# EasyEDA Pro project Karma_flight_ computer.epro

# Schematic FLIGHT COMPUTER-2

## Sheets
1 FLIGHT COMPUTER - 2: Board Name: FLIGHT COMPUTER-2; Create Date: 2025-08-07; Page Name: FLIGHT COMPUTER - 2; Project Name: KARMA-FC; Schematic Name: FLIGHT COMPUTER-2; Update Date: 2025-08-09; Add into BOM: yes; Company: VRT; Convert to PCB: yes; Date: 2025-07-24; Draw By: amit.shukla3011; REV: 1.0; Sheet: 1/1; spicePre: .
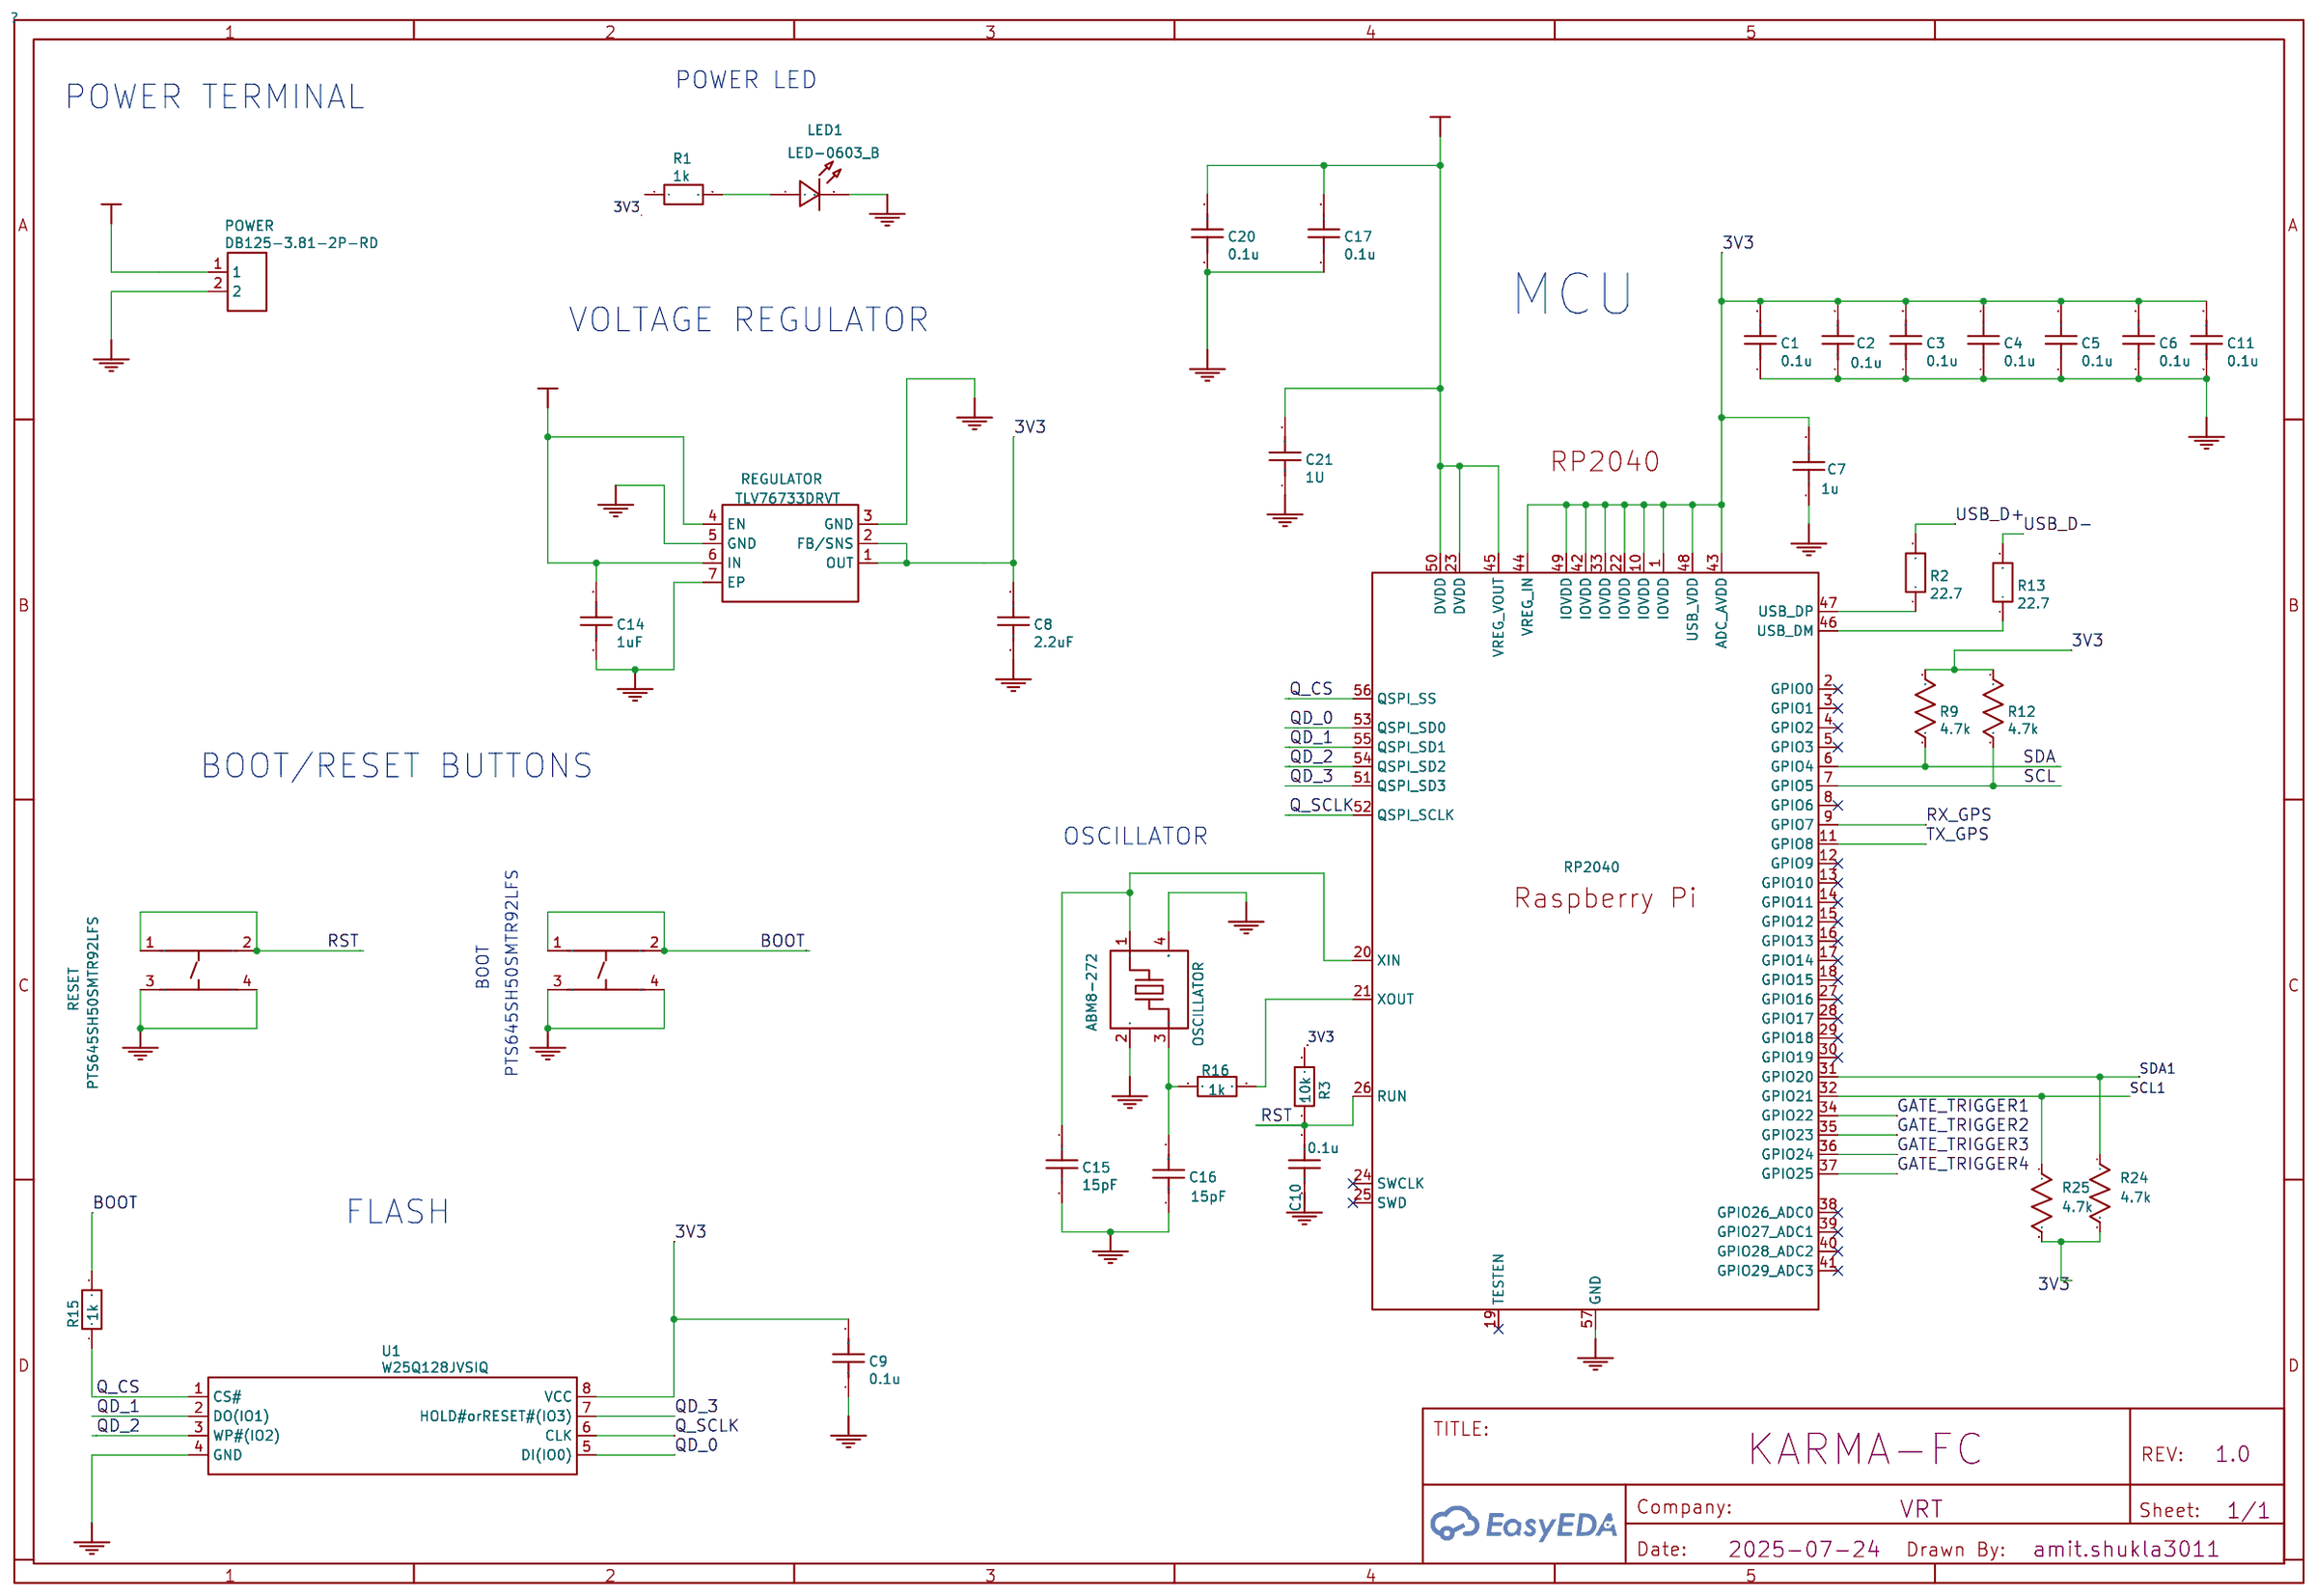
[diagram p0: FLIGHT COMPUTER - 2]
2 Sheet_2: Page Name: Sheet_2; Company: Your Company; Date: 2025-07-28
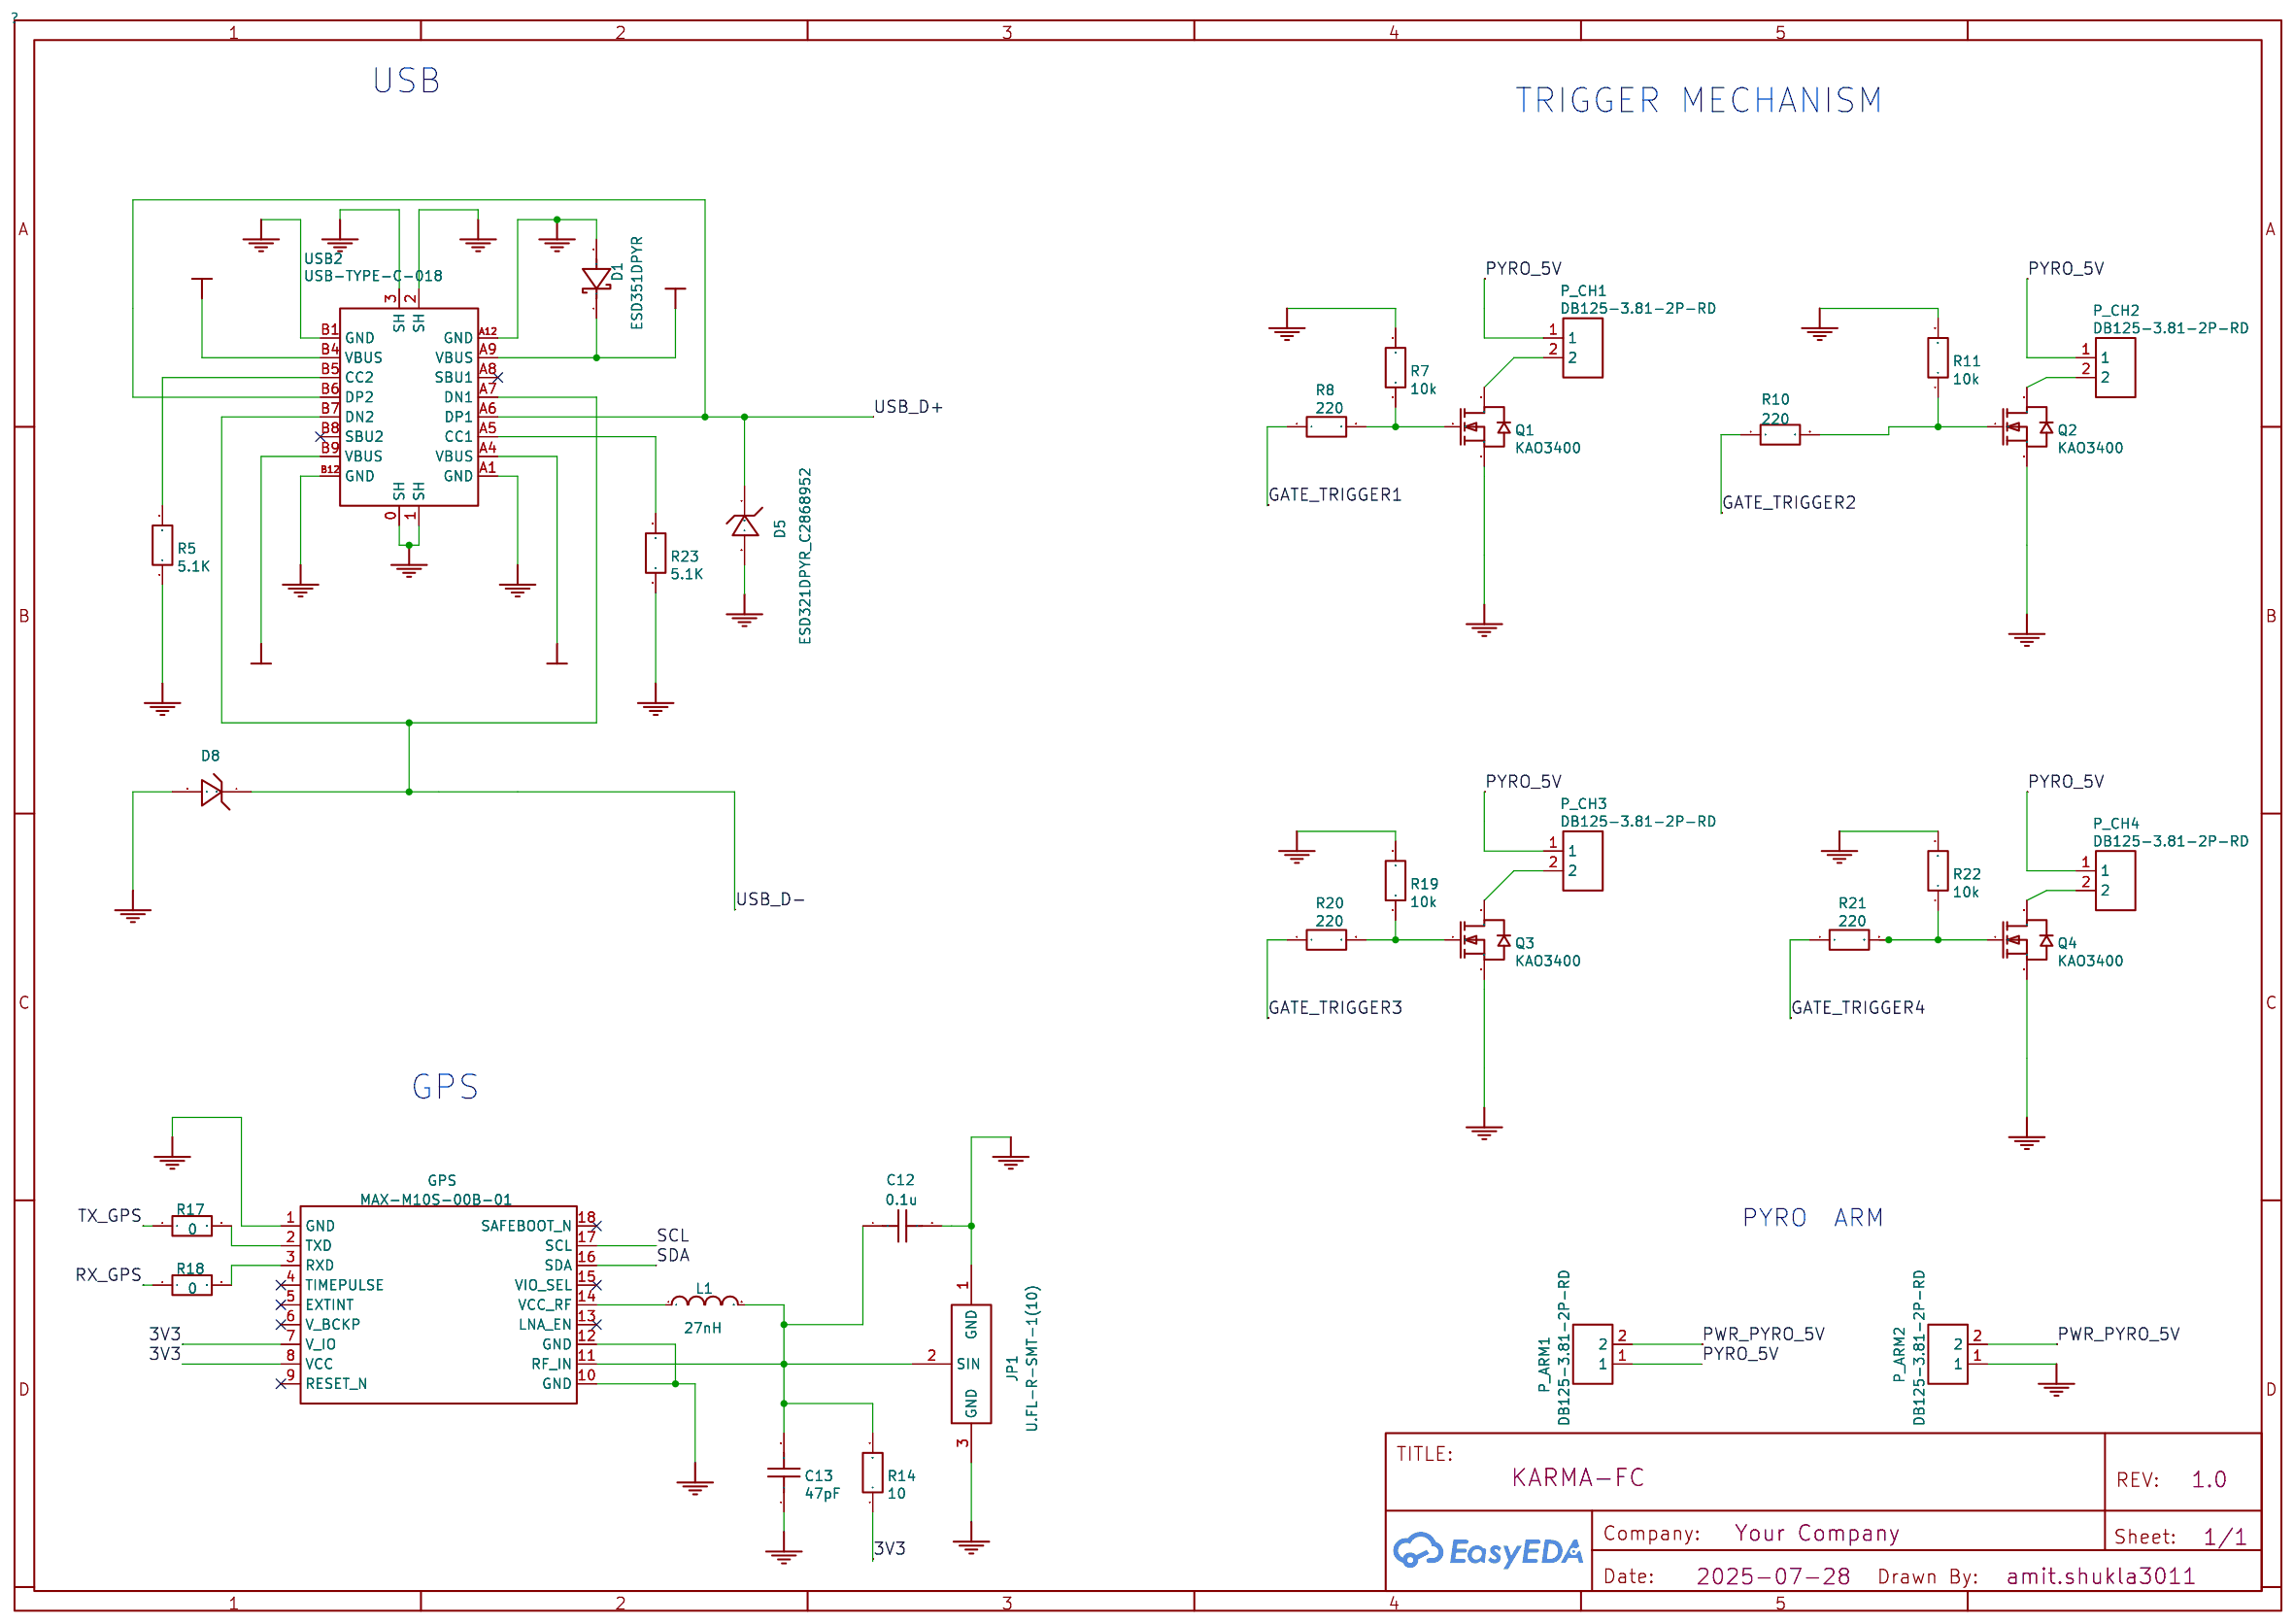
[diagram p1: Sheet_2]
3 Sheet_3: Page Name: Sheet_3; Company: Your Company; Date: 2025-07-28
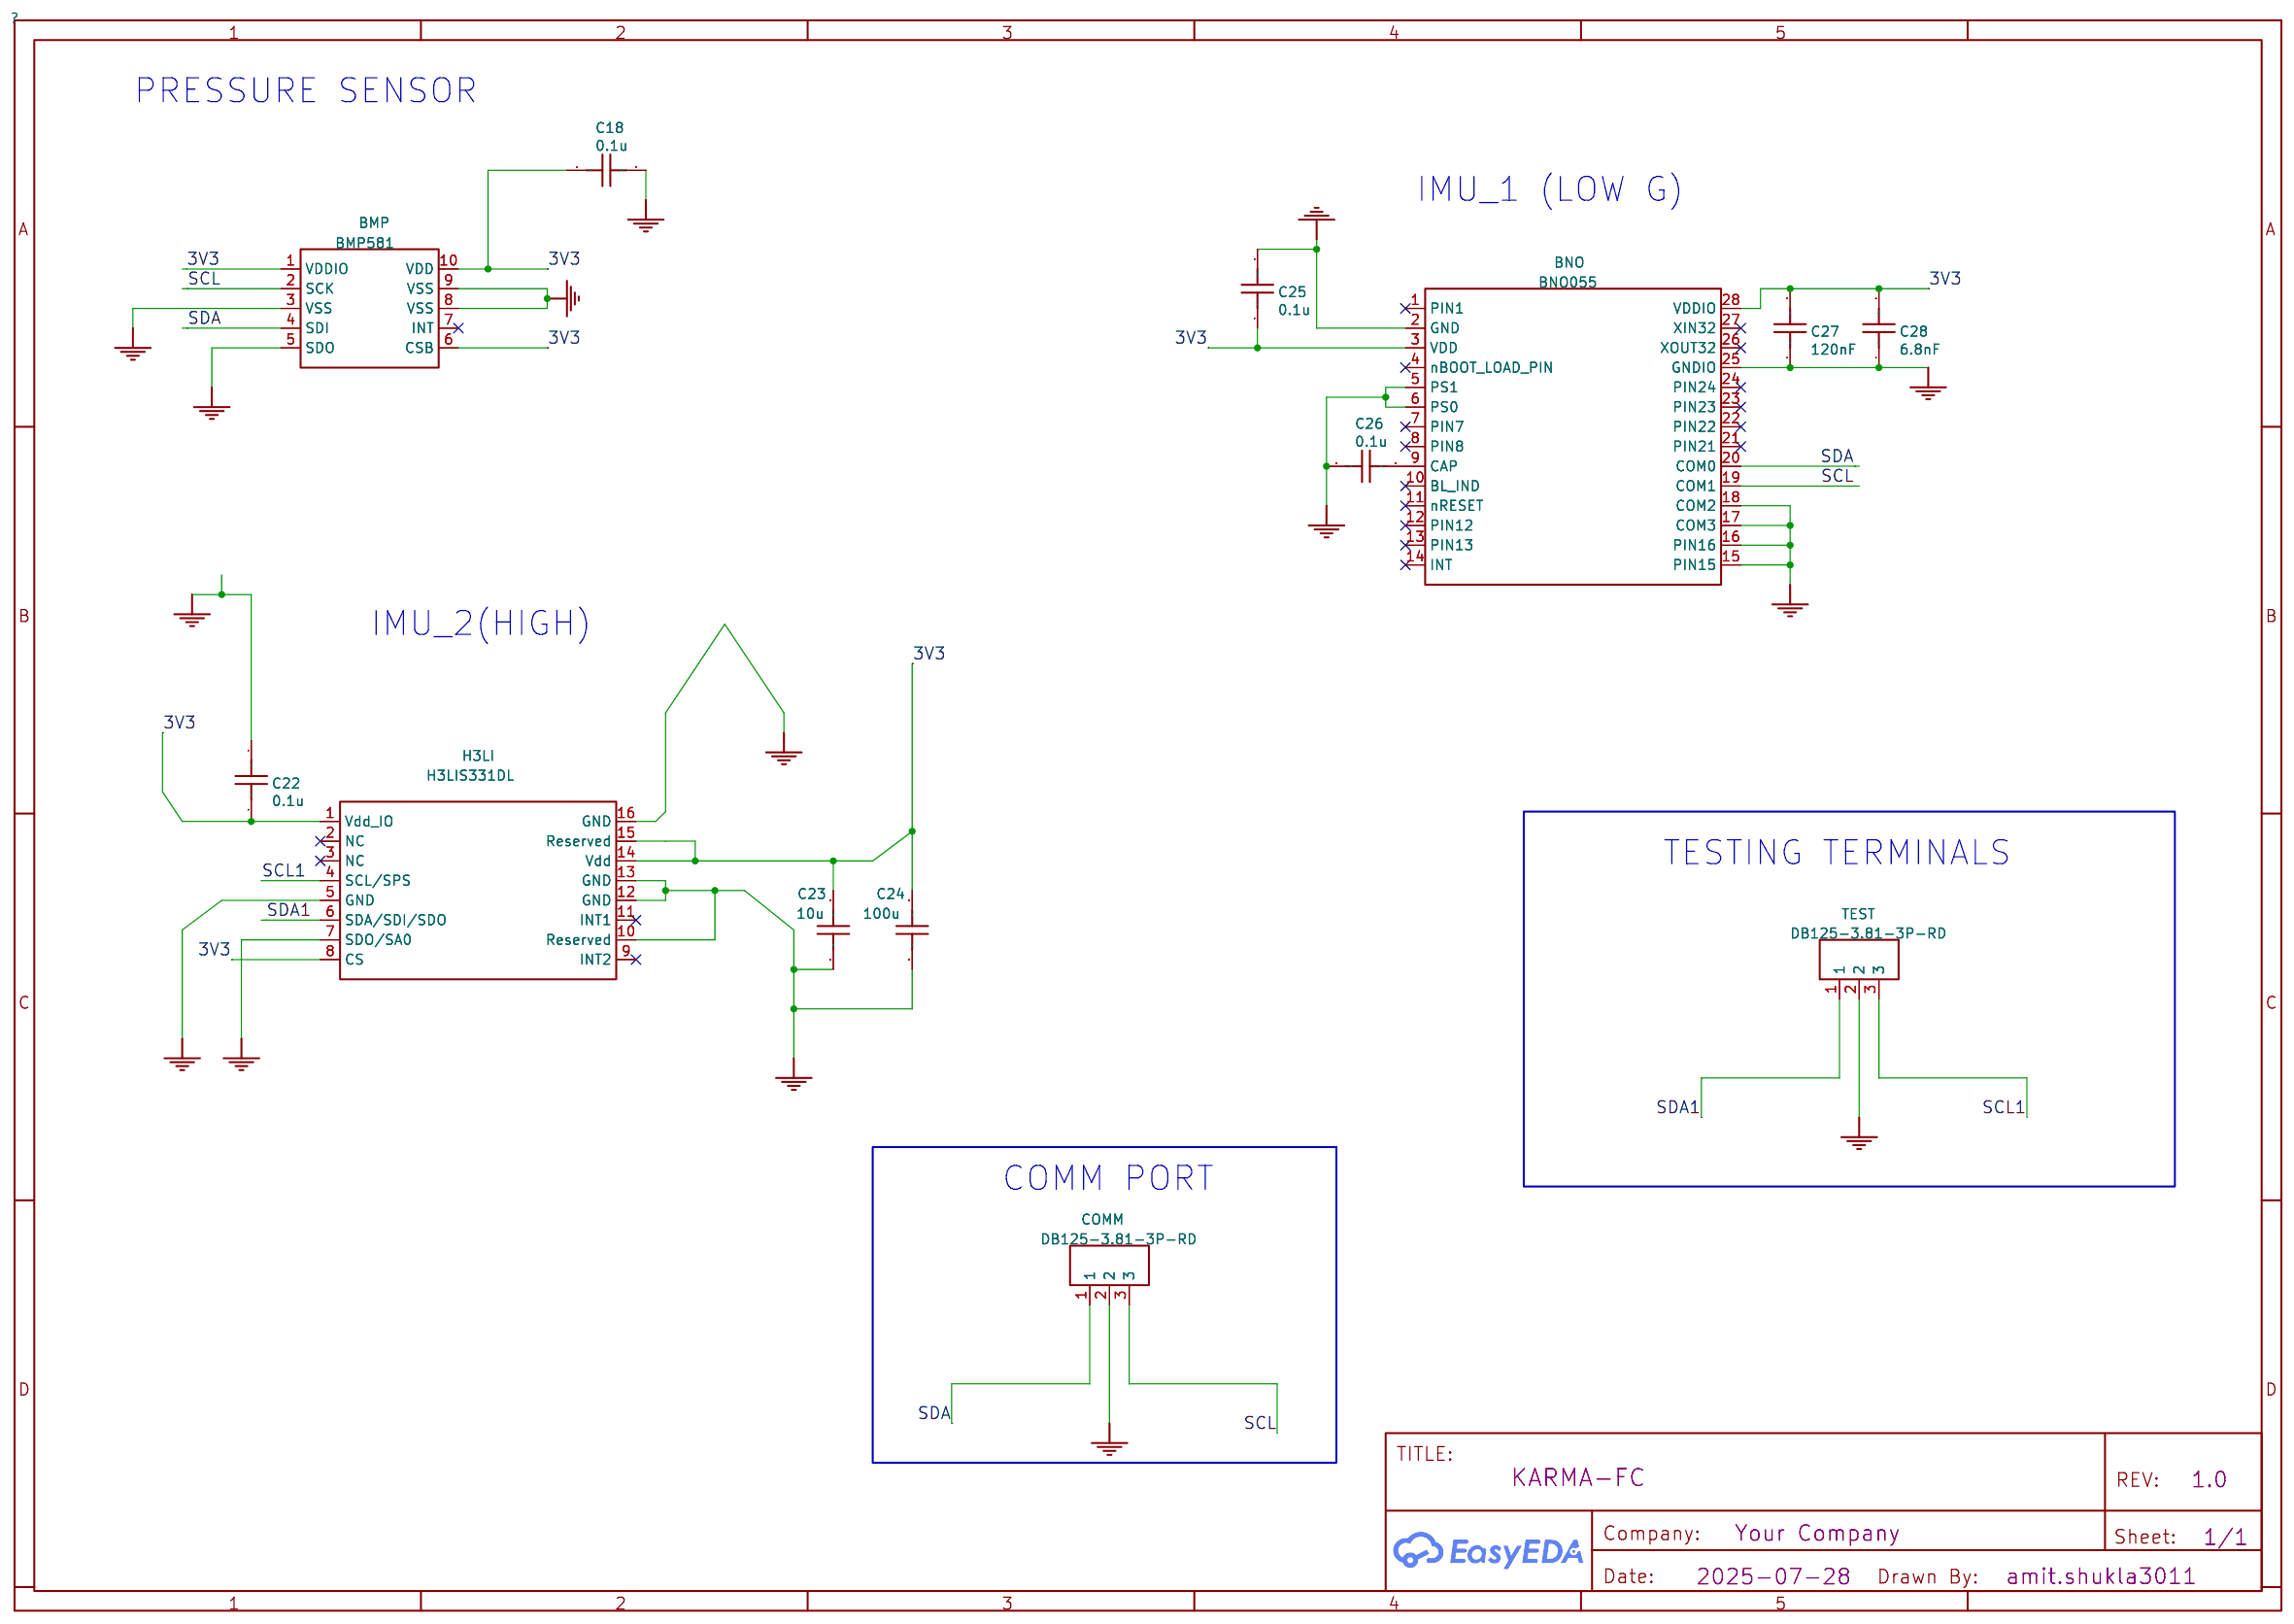
[diagram p2: Sheet_3]

## Parts
sheet FLIGHT COMPUTER - 2
C1  0.1u  [C0402]
C2  0.1u  [C0402]
C3  0.1u  [C0402]
C4  0.1u  [C0402]
C5  0.1u  [C0402]
C6  0.1u  [C0402]
C7  1u  [C0402]
C8  2.2uF  [C0603]
C9  0.1u  [C0603]
C10  0.1u  [C0603]
C11  0.1u  [C0402]
C14  1uF  [C0603]
C15  15pF  [C0603]
C16  15pF  [C0603]
C17  0.1u  [C0402]
C20  0.1u  [C0402]
C21  1U  [C0402]
LED1  LED-0603_B  [LED0603_BLUE]
OSCILLATOR  ABM8-272  [CRYSTAL-SMD_4P-L3.2-W2.5-BL]
POWER  DB125-3.81-2P-RD  [CONN-TH_DB125-3.81-2P-RD]
R1  1k  [R0603]
R2  22.7  [R0603]
R3  10k  [R0603]
R9  4.7k  [R0603]
R12  4.7k  [R0603]
R13  22.7  [R0603]
R15  1k  [R0603]
R16  1k  [R0603]
R24  4.7k  [R0603]
R25  4.7k  [R0603]
REGULATOR  TLV76733DRVT  [WSON-6_L2.0-W2.0-P0.65-TL-EP]
RESET  PTS645SH50SMTR92LFS  [KEY-SMD_4P-L6.0-W6.0-P4.50-LS9.0]
RP2040  RP2040  [LQFN-56_L7.0-W7.0-P0.4-EP]
SW2  PTS645SH50SMTR92LFS  [KEY-SMD_4P-L6.0-W6.0-P4.50-LS9.0]
U1  W25Q128JVSIQ  [SOIC-8_L5.3-W5.3-P1.27-LS8.0-BL]
sheet Sheet_2
C12  0.1u  [C0603]
C13  47pF  [C0603]
D1  ESD351DPYR  [X1SON-2_L1.0-W0.6-P0.65-RD-1]
D5  ESD321DPYR_C2868952  [X1SON-2_L1.0-W0.6-P0.65-RD]
D8  ESD321DPYR_C2868952  [X1SON-2_L1.0-W0.6-P0.65-RD]
GPS  MAX-M10S-00B-01  [GPS-SMD_18P-L10.1-W9.7-P1.10-BR]
JP1  U.FL-R-SMT-1(10)  [ANT-SMD_UFL-R-SMT-1-10]
L1  27nH  [L0603]
P_ARM1  DB125-3.81-2P-RD  [CONN-TH_DB125-3.81-2P-RD]
P_ARM2  DB125-3.81-2P-RD  [CONN-TH_DB125-3.81-2P-RD]
P_CH1  DB125-3.81-2P-RD  [CONN-TH_DB125-3.81-2P-RD]
P_CH2  DB125-3.81-2P-RD  [CONN-TH_DB125-3.81-2P-RD]
P_CH3  DB125-3.81-2P-RD  [CONN-TH_DB125-3.81-2P-RD]
P_CH4  DB125-3.81-2P-RD  [CONN-TH_DB125-3.81-2P-RD]
Q1  KAO3400  [SOT-23-3_L2.9-W1.3-P1.90-LS2.4-BR]
Q2  KAO3400  [SOT-23-3_L2.9-W1.3-P1.90-LS2.4-BR]
Q3  KAO3400  [SOT-23-3_L2.9-W1.3-P1.90-LS2.4-BR]
Q4  KAO3400  [SOT-23-3_L2.9-W1.3-P1.90-LS2.4-BR]
R5  5.1K  [R0603]
R7  10k  [R0603]
R8  220  [R0603]
R10  220  [R0603]
R11  10k  [R0603]
R14  10  [R0603]
R17  0  [R0603]
R18  0  [R0603]
R19  10k  [R0603]
R20  220  [R0603]
R21  220  [R0603]
R22  10k  [R0603]
R23  5.1K  [R0603]
USB2  USB-TYPE-C-018  [USB-C_SMD-TYPE-C-31-M-12]
sheet Sheet_3
BMP  BMP581  [LGA-10_L2.0-W2.0-P0.50-TL_BMP581]
BNO  BNO055  [LGA-28_L5.2-W3.8-P0.50-BL]
C18  0.1u  [C0603]
C22  0.1u  [C0603]
C23  10u  [C0603]
C24  100u  [C0603]
C25  0.1u  [C0603]
C26  0.1u  [C0603]
C27  120nF  [C0603]
C28  6.8nF  [C0603]
COMM  DB125-3.81-3P-RD  [CONN-TH_3P-P3.81_L7.4-W11.4]
H3LI  H3LIS331DL  [LGA-16_L3.0-W3.0-P0.50-BL]
TEST  DB125-3.81-3P-RD  [CONN-TH_3P-P3.81_L7.4-W11.4]

## Library data of the parts
C1-C6 C11 C17 C20 = 0.1u: nameAlias: Value(F); Contributor: LCEDA_Lib; spicePre: C; spiceSymbolName: C_0402_US
C7 = 1u: nameAlias: Value(F); Contributor: LCEDA_Lib; spicePre: C; spiceSymbolName: C_0402_US
C8 = 2.2uF: nameAlias: Value(F); Contributor: LCEDA_Lib; spicePre: C; spiceSymbolName: C_0603_US
C9 C10 C12 C18 C22 C25 C26 = 0.1u: nameAlias: Value(F); Contributor: LCEDA_Lib; spicePre: C; spiceSymbolName: C_0603_US
C14 = 1uF: nameAlias: Value(F); Contributor: LCEDA_Lib; spicePre: C; spiceSymbolName: C_0603_US
C15 C16 = 15pF: nameAlias: Value(F); Contributor: LCEDA_Lib; spicePre: C; spiceSymbolName: C_0603_US
C21 = 1U: nameAlias: Value(F); Contributor: LCEDA_Lib; spicePre: C; spiceSymbolName: C_0402_US
LED1 = LED-0603_B: Manufacturer: EVERLIGHT(台湾亿光); Manufacturer Part: 19-217/BHC-ZL1M2RY/3T; Supplier Part: C72041; Supplier: LCSC; Contributor: LCEDA_01; spicePre: L
OSCILLATOR = ABM8-272: Supplier: LCSC; Supplier Part: C20625731; Manufacturer: ABRACON; Manufacturer Part: ABM8-272-T3; JLCPCB Part Class: Extended Part; Contributor: lcsc; spicePre: U; spiceSymbolName: ABM8-272-T3_C20625731
P_ARM1 P_ARM2 P_CH1-P_CH4 POWER = DB125-3.81-2P-RD: Supplier: LCSC; Supplier Part: C881703; Manufacturer: DORABO(地博电气); Manufacturer Part: DB125-3.81-2P-RD-S; JLCPCB Part Class: Extended Part; Contributor: LCSC; spicePre: U
R1 R15 R16 = 1k: nameAlias: Value(Ω); Contributor: LCEDA_Lib; spicePre: R; spiceSymbolName: R_0603_EU
R2 R13 = 22.7: nameAlias: Value(Ω); Contributor: LCEDA_Lib; spicePre: R; spiceSymbolName: R_0603_EU
R3 R7 R11 R19 R22 = 10k: nameAlias: Value(Ω); Contributor: LCEDA_Lib; spicePre: R; spiceSymbolName: R_0603_EU
R9 R12 R24 R25 = 4.7k: nameAlias: Value(Ω); Contributor: LCEDA_Lib; spicePre: R; spiceSymbolName: R_0603_US
REGULATOR = TLV76733DRVT: Supplier: LCSC; Supplier Part: C2867572; Manufacturer: TI(德州仪器); JLCPCB Part Class: Extended Part; Contributor: LCSC; spicePre: U
RESET SW2 = PTS645SH50SMTR92LFS: Supplier: LCSC; Supplier Part: C221869; Manufacturer: C&K; JLCPCB Part Class: Extended Part; Contributor: LCSC; spicePre: S
RP2040 = RP2040: Supplier: LCSC; Supplier Part: C2040; Manufacturer: Raspberry Pi(树莓派); JLCPCB Part Class: Extended Part; Contributor: LCSC; spicePre: U
U1 = W25Q128JVSIQ: Supplier: LCSC; Supplier Part: C113767; Manufacturer: Winbond(华邦); JLCPCB Part Class: Extended Part; Contributor: LCSC; spicePre: U
C13 = 47pF: nameAlias: Value(F); Contributor: LCEDA_Lib; spicePre: C; spiceSymbolName: C_0603_US
D1 = ESD351DPYR: Supplier: LCSC; Supplier Part: C1974929; Manufacturer: TI(德州仪器); JLCPCB Part Class: Extended Part; Contributor: LCSC; spicePre: D
D5 D8 = ESD321DPYR_C2868952: Supplier: LCSC; Supplier Part: C2868952; Manufacturer: TI(德州仪器); Manufacturer Part: ESD321DPYR; JLCPCB Part Class: Extended Part; Contributor: lcsc; spicePre: D
GPS = MAX-M10S-00B-01: Supplier: LCSC; Supplier Part: C24834155; Manufacturer: U-BLOX; JLCPCB Part Class: Extended Part; Contributor: lcsc; spicePre: U
JP1 = U.FL-R-SMT-1(10): Supplier: LCSC; Manufacturer: HRS(广濑); Supplier Part: C88373; JLCPCB Part Class: Extended Part; spicePre: J
L1 = 27nH: nameAlias: Value(H); Contributor: LCEDA_Lib; spicePre: L; spiceSymbolName: L0603_US
Q1-Q4 = KAO3400: Supplier: LCSC; Supplier Part: C2891617; Manufacturer: KUU; JLCPCB Part Class: Extended Part; Contributor: LCSC; spicePre: Q
R5 R23 = 5.1K: nameAlias: Value(Ω); Contributor: LCEDA_Lib; spicePre: R; spiceSymbolName: R_0603_EU
R8 R10 R20 R21 = 220: nameAlias: Value(Ω); Contributor: LCEDA_Lib; spicePre: R; spiceSymbolName: R_0603_EU
R14 = 10: nameAlias: Value(Ω); Contributor: LCEDA_Lib; spicePre: R; spiceSymbolName: R_0603_EU
R17 R18 = 0: nameAlias: Value(Ω); Contributor: LCEDA_Lib; spicePre: R; spiceSymbolName: R_0603_EU
USB2 = USB-TYPE-C-018: Supplier: LCSC; Supplier Part: C2927038; Manufacturer: DEALON(德艺隆); JLCPCB Part Class: Extended Part; Contributor: LCSC; spicePre: U
BMP = BMP581: Supplier: LCSC; Supplier Part: C5362283; Manufacturer: Bosch(博世); JLCPCB Part Class: Extended Part; Contributor: lcsc; spicePre: U
BNO = BNO055: Supplier: LCSC; Supplier Part: C93216; Manufacturer: Bosch(博世); JLCPCB Part Class: Extended Part; Contributor: LCSC; spicePre: U
C23 = 10u: nameAlias: Value(F); Contributor: LCEDA_Lib; spicePre: C; spiceSymbolName: C_0603_US
C24 = 100u: nameAlias: Value(F); Contributor: LCEDA_Lib; spicePre: C; spiceSymbolName: C_0603_US
C27 = 120nF: nameAlias: Value(F); Contributor: LCEDA_Lib; spicePre: C; spiceSymbolName: C_0603_US
C28 = 6.8nF: nameAlias: Value(F); Contributor: LCEDA_Lib; spicePre: C; spiceSymbolName: C_0603_US
COMM TEST = DB125-3.81-3P-RD: Supplier: LCSC; Supplier Part: C2858301; Manufacturer: DORABO(地博电气); Manufacturer Part: DB125-3.81-3P-RD-S; JLCPCB Part Class: Extended Part; Contributor: LCSC; spicePre: C
H3LI = H3LIS331DL: Supplier: LCSC; Supplier Part: C1526874; Manufacturer: ST(意法半导体); JLCPCB Part Class: Extended Part; Contributor: LCSC; spicePre: U

## Nets
3V3: BMP.1(VDDIO) BMP.6(CSB) BMP.10(VDD) BNO.3(VDD) BNO.28(VDDIO) C1.2 C2.2 C3.2 C4.2 C5.2 C6.2 C7.2 C8.2 C9.2 C11.2 C18.1 C22.1 C23.2 C24.2 C25.1 C27.2 C28.2 GPS.7(V_IO) GPS.8(VCC) H3LI.1(Vdd_IO) H3LI.8(CS) H3LI.14(Vdd) H3LI.15(Reserved) R1.1 R3.2 R9.2 R12.2 R14.1 R24.2 R25.2 REGULATOR.1(OUT) REGULATOR.2(FB/SNS) RP2040.1(IOVDD) RP2040.10(IOVDD) RP2040.22(IOVDD) RP2040.33(IOVDD) RP2040.42(IOVDD) RP2040.43(ADC_AVDD) RP2040.44(VREG_IN) RP2040.48(USB_VDD) RP2040.49(IOVDD) U1.8(VCC)
+1V: C17.2 C20.2 C21.2 RP2040.23(DVDD) RP2040.45(VREG_VOUT) RP2040.50(DVDD)
+5V: C14.2 D1.1(K) POWER.1 REGULATOR.4(EN) REGULATOR.6(IN) USB2.A4(VBUS) USB2.A9(VBUS) USB2.B4(VBUS) USB2.B9(VBUS)
GND: BMP.3(VSS) BMP.5(SDO) BMP.8(VSS) BMP.9(VSS) BNO.2(GND) BNO.5(PS1) BNO.6(PS0) BNO.15(PIN15) BNO.16(PIN16) BNO.17(COM3) BNO.18(COM2) BNO.25(GNDIO) C1.1 C2.1 C3.1 C4.1 C5.1 C6.1 C7.1 C8.1 C9.1 C10.1 C11.1 C12.2 C13.1 C14.1 C15.1 C16.1 C17.1 C18.2 C20.1 C21.1 C22.2 C23.1 C24.1 C25.2 C26.1 C27.1 C28.1 COMM.2 D1.2(A) D5.2(A) D8.2(A) GPS.1(GND) GPS.10(GND) GPS.12(GND) H3LI.5(GND) H3LI.7(SDO/SA0) H3LI.10(Reserved) H3LI.12(GND) H3LI.13(GND) H3LI.16(GND) JP1.1(GND) JP1.3(GND) LED1.2 OSCILLATOR.2(GND) OSCILLATOR.4(GND) P_ARM2.1 POWER.2 Q1.2(S) Q2.2(S) Q3.2(S) Q4.2(S) R5.1 R7.2 R11.2 R19.2 R22.2 R23.1 REGULATOR.3(GND) REGULATOR.5(GND) REGULATOR.7(EP) RESET.3 RESET.4 RP2040.57(GND) SW2.3 SW2.4 TEST.2 U1.4(GND) USB2.0(SH) USB2.1(SH) USB2.2(SH) USB2.3(SH) USB2.A1(GND) USB2.A12(GND) USB2.B1(GND) USB2.B12(GND)
BOOT: R15.2 SW2.1 SW2.2
GATE_TRIGGER1: R8.1 RP2040.34(GPIO22)
GATE_TRIGGER2: R10.1 RP2040.35(GPIO23)
GATE_TRIGGER3: R20.1 RP2040.36(GPIO24)
GATE_TRIGGER4: R21.1 RP2040.37(GPIO25)
PWR_PYRO_5V: P_ARM1.2 P_ARM2.2
PYRO_5V: P_ARM1.1 P_CH1.1 P_CH2.1 P_CH3.1 P_CH4.1
Q_CS: R15.1 RP2040.56(QSPI_SS) U1.1(CS#)
Q_SCLK: RP2040.52(QSPI_SCLK) U1.6(CLK)
QD_0: RP2040.53(QSPI_SD0) U1.5(DI(IO0))
QD_1: RP2040.55(QSPI_SD1) U1.2(DO(IO1))
QD_2: RP2040.54(QSPI_SD2) U1.3(WP#(IO2))
QD_3: RP2040.51(QSPI_SD3) U1.7(HOLD#orRESET#(IO3))
RST: C10.2 R3.1 RESET.1 RESET.2 RP2040.26(RUN)
RX_GPS: R18.1 RP2040.9(GPIO7)
SCL: BMP.2(SCK) BNO.19(COM1) COMM.3 GPS.17(SCL) R12.1 RP2040.7(GPIO5)
SCL1: H3LI.4(SCL/SPS) R25.1 RP2040.32(GPIO21) TEST.3
SDA: BMP.4(SDI) BNO.20(COM0) COMM.1 GPS.16(SDA) R9.1 RP2040.6(GPIO4)
SDA1: H3LI.6(SDA/SDI/SDO) R24.1 RP2040.31(GPIO20) TEST.1
TX_GPS: R17.1 RP2040.11(GPIO8)
USB_D+: D5.1(C) R2.2 USB2.A6(DP1) USB2.B6(DP2)
USB_D-: D8.1(C) R13.2 USB2.A7(DN1) USB2.B7(DN2)
$1N42: R13.1 RP2040.46(USB_DM)
$1N55: C15.2 OSCILLATOR.1 RP2040.20(XIN)
$1N58: R16.2 RP2040.21(XOUT)
$1N60: C16.2 OSCILLATOR.3 R16.1
$1N1983: R2.1 RP2040.47(USB_DP)
$2N3: P_CH2.2 Q2.3(D)
$2N4: P_CH1.2 Q1.3(D)
$2N6: Q2.1(G) R10.2 R11.1
$2N9: Q1.1(G) R7.1 R8.2
$2N14: Q3.1(G) R19.1 R20.2
$2N17: Q4.1(G) R21.2 R22.1
$2N19: P_CH3.2 Q3.3(D)
$2N20: P_CH4.2 Q4.3(D)
$2N49: C12.1 C13.2 GPS.11(RF_IN) JP1.2(SIN) L1.2 R14.2
$2N54: GPS.14(VCC_RF) L1.1
$2N63: GPS.2(TXD) R17.2
$2N64: GPS.3(RXD) R18.2
$3N377: BNO.9(CAP) C26.2
Net-(LED1-1): LED1.1 R1.2
Net-(R5-2): R5.2 USB2.B5(CC2)
Net-(R23-2): R23.2 USB2.A5(CC1)

Not connected (* = marked no-connect by the designer): BMP 7(INT)*; BNO 1(PIN1)* 4(nBOOT_LOAD_PIN)* 7(PIN7)* 8(PIN8)* 10(BL_IND)* 11(nRESET)* 12(PIN12)* 13(PIN13)* 14(INT)* 21(PIN21)* 22(PIN22)* 23(PIN23)* 24(PIN24)* 26(XOUT32)* 27(XIN32)*; GPS 4(TIMEPULSE)* 5(EXTINT)* 6(V_BCKP)* 9(RESET_N)* 13(LNA_EN)* 15(VIO_SEL)* 18(SAFEBOOT_N)*; H3LI 2(NC)* 3(NC)* 9(INT2)* 11(INT1)*; RP2040 2(GPIO0)* 3(GPIO1)* 4(GPIO2)* 5(GPIO3)* 8(GPIO6)* 12(GPIO9)* 13(GPIO10)* 14(GPIO11)* 15(GPIO12)* 16(GPIO13)* 17(GPIO14)* 18(GPIO15)* 19(TESTEN)* 24(SWCLK)* 25(SWD)* 27(GPIO16)* 28(GPIO17)* 29(GPIO18)* 30(GPIO19)* 38(GPIO26_ADC0)* 39(GPIO27_ADC1)* 40(GPIO28_ADC2)* 41(GPIO29_ADC3)*; USB2 A8(SBU1)* B8(SBU2)*

## Notes on the sheets
sheet 1
- POWER LED
- POWER TERMINAL
- MCU
- VOLTAGE REGULATOR
- BOOT/RESET BUTTONS
- OSCILLATOR
- BOOT
- PTS645SH50SMTR92LFS
- FLASH
sheet 2
- USB
- TRIGGER MECHANISM
- GPS
- PYRO  ARM
sheet 3
- PRESSURE SENSOR
- IMU_1 (LOW G)
- IMU_2(HIGH)
- TESTING TERMINALS
- COMM PORT

# Board 1-PCB_PCB_FLIGHT COMPUTER-2
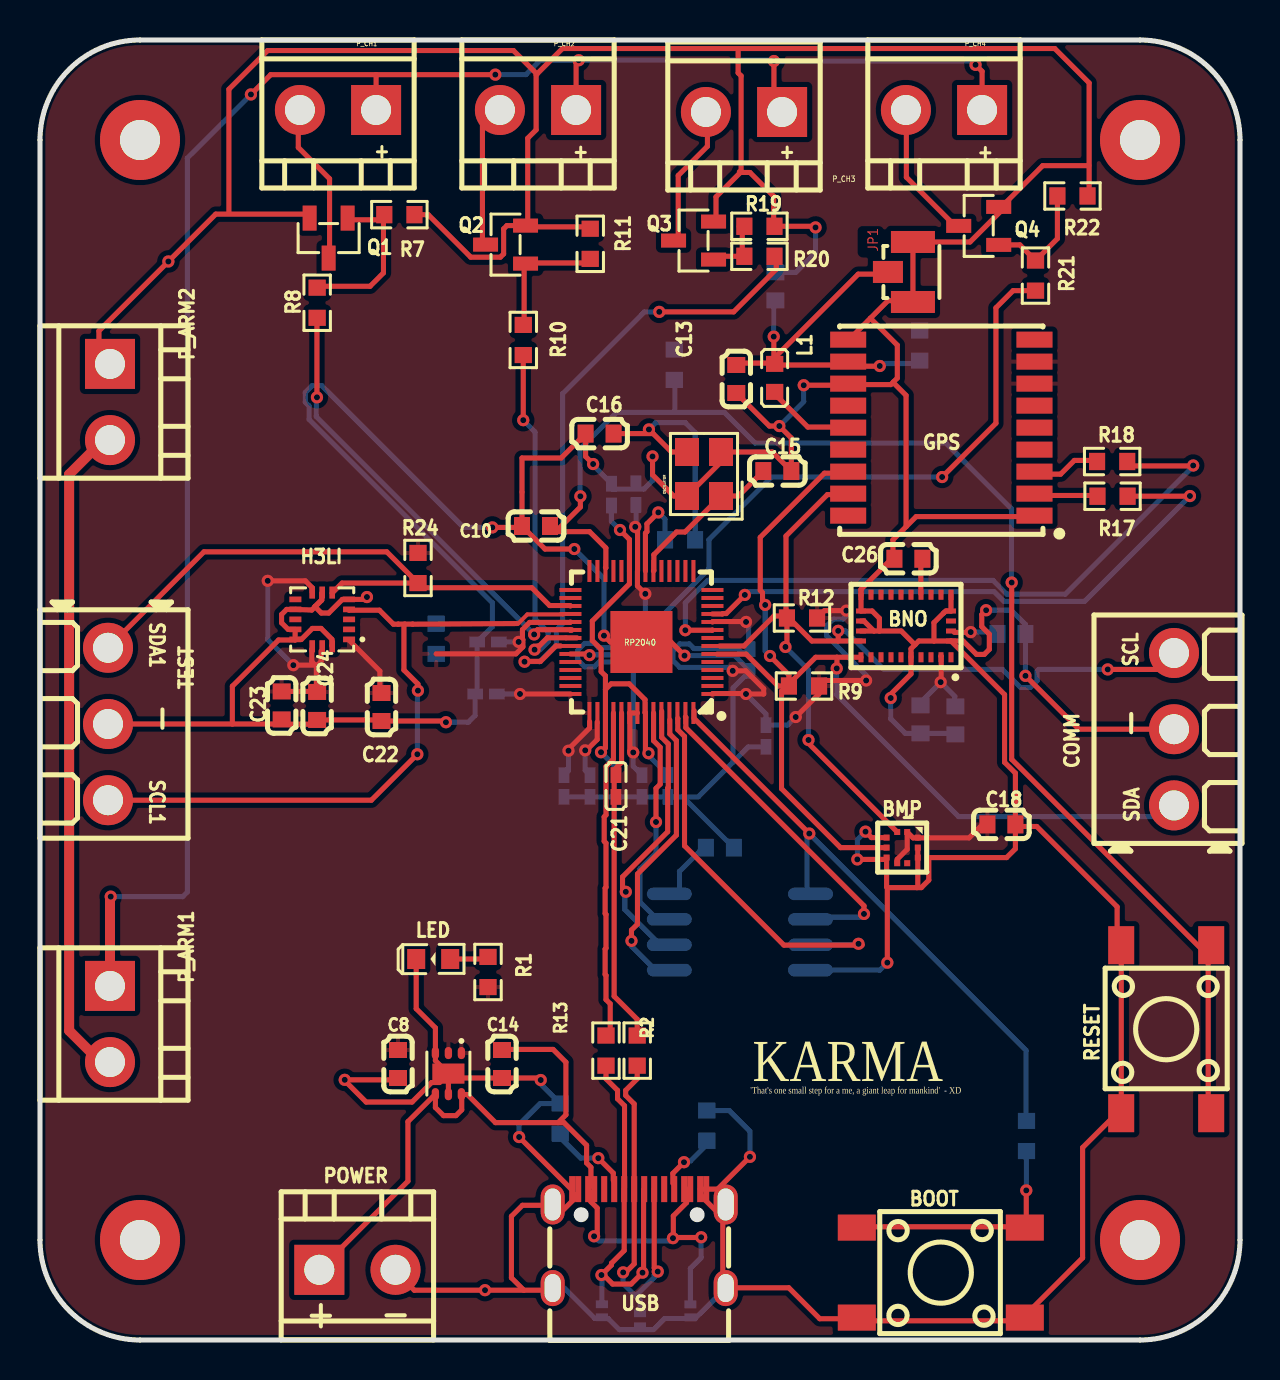
[diagram p3: board, top side]
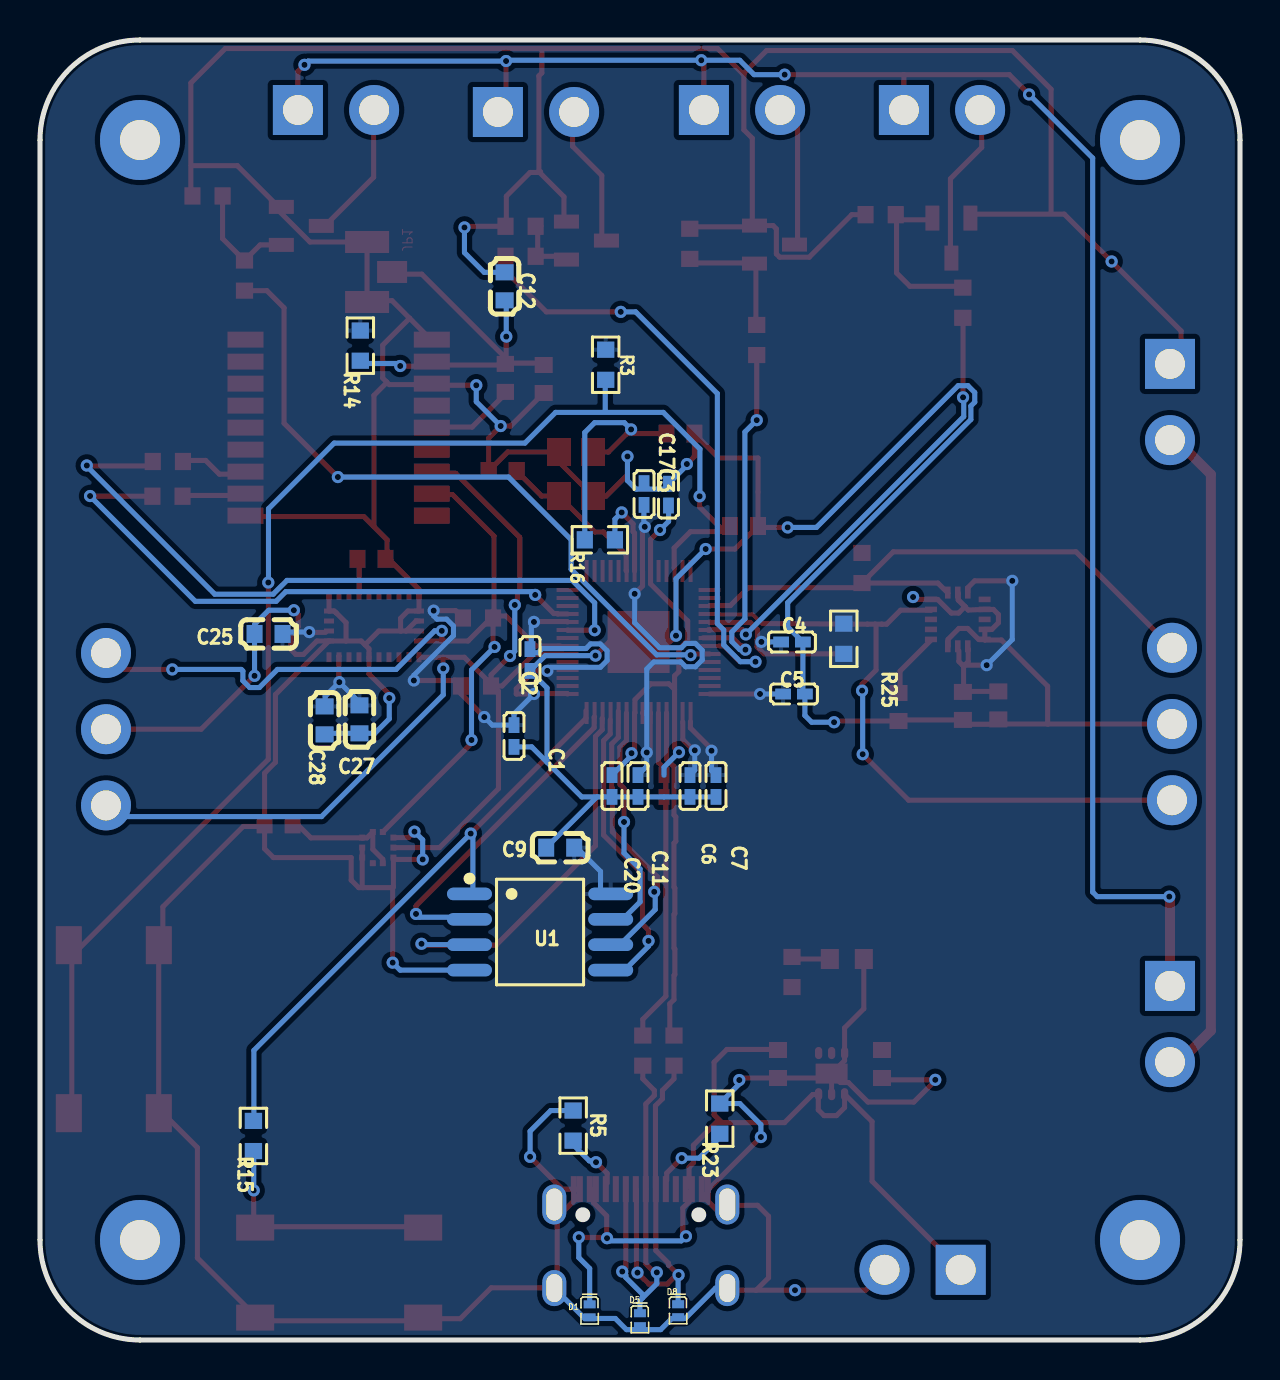
[diagram p4: board, bottom side, seen from below]

Outline 60 x 65 mm; copper layers: Top Layer, GND, GND2, Bottom Layer. Coordinates in mm from the lower left corner of the outline.
Outline path: 0,60 0,5 arc(1.46,1.46) 5,0 55,0 arc(58.54,1.46) 60,5 60,60 arc(58.54,63.54) 55,65 5,65 arc(1.46,63.54) 0,60
Stack: Top Layer 0.035mm Outer layer thickness 1oz / Dielectric1 0.2104mm 7628 RC49% 8.6mil / GND 0.0152mm Inner layer thickness / Dielectric2 1.065mm 1.1mm H/HOZ Copper / GND2 0.0152mm Inner layer thickness / Dielectric3 0.2104mm 7628 RC49% 8.6mil / Bottom Layer 0.035mm Outer layer thickness 1oz

## Design rules (mm)
net USB_D+: DP1
net USB_D-: DP1
net $1N42: DP2
net $1N1983: DP2
template: JLCPCB Capability(Multiple Layers Board)
spacing copperThickness1oz (default): track to track 0.102, other pairs 0.152 to 0.3
spacing copperThickness2oz: track to track 0.203, other pairs 0.152 to 0.3
spacing copperThicknessInner0.5oz: track to track 0.089, other pairs 0.152 to 0.3
track width copperThickness1oz (default): min 0.102, default 0.254, max 2.54
track width copperThickness0.5oz: min 0.089, default 0.254, max 2.54
track width copperThickness2oz: min 0.203, default 0.254, max 2.54
differential pair differentialPair (default): width min 0.127, default 0.254, max 2.54; gap min 0.152, default 0.152
via viaSize (default): diameter min 0.3, default 0.61, max 10; hole min 0.2, default 0.305, max 6.3

## Placement (name value [footprint] x y rotation side)
BMP  BMP581  [LGA-10_L2.0-W2.0-P0.50-TL_BMP581]  43.11 24.62 270 top
BNO  BNO055  [LGA-28_L5.2-W3.8-P0.50-BL]  43.3 35.7 90 top
BOOT  PTS645SH50SMTR92LFS  [KEY-SMD_4P-L6.0-W6.0-P4.50-LS9.0]  45.04 3.37 0 top
C1  0.1u  [C0402]  36.3 30.2 90 bottom
C2  0.1u  [C0402]  35.5 34 90 bottom
C3  0.1u  [C0402]  29.8 42.3 270 bottom
C4  0.1u  [C0402]  22.4 34.9 0 bottom
C5  0.1u  [C0402]  22.3 32.3 0 bottom
C6  0.1u  [C0402]  27.5 27.7 90 bottom
C7  1u  [C0402]  26.2 27.7 90 bottom
C8  2.2uF  [C0603]  17.9 13.8 90 top
C9  0.1u  [C0603]  33.99 24.62 180 bottom
C10  0.1u  [C0603]  24.8 40.7 0 top
C11  0.1u  [C0402]  30.1 27.7 90 bottom
C12  0.1u  [C0603]  36.77 52.68 90 bottom
C13  47pF  [C0603]  34.81 48.05 90 top
C14  1uF  [C0603]  23.1 13.8 90 top
C15  15pF  [C0603]  36.87 43.45 180 top
C16  15pF  [C0603]  27.98 45.32 0 top
C17  0.1u  [C0402]  28.58 42.27 270 bottom
C18  0.1u  [C0603]  48.07 25.78 0 top
C20  0.1u  [C0402]  31.4 27.7 90 bottom
C21  1U  [C0402]  28.8 27.7 90 top
C22  0.1u  [C0603]  17.07 31.65 270 top
C23  10u  [C0603]  12.08 31.73 90 top
C24  100u  [C0603]  13.86 31.7 90 top
C25  0.1u  [C0603]  48.57 35.3 0 bottom
C26  0.1u  [C0603]  43.42 39.06 0 top
C27  120nF  [C0603]  44.03 31.03 90 bottom
C28  6.8nF  [C0603]  45.77 30.98 90 bottom
COMM  DB125-3.81-3P-RD  [CONN-TH_3P-P3.81_L7.4-W11.4]  56.7 30.54 90 top
D1  ESD351DPYR  [X1SON-2_L1.0-W0.6-P0.65-RD-1]  32.52 1.46 270 bottom
D5  ESD321DPYR_C2868952  [X1SON-2_L1.0-W0.6-P0.65-RD]  30 1.01 270 bottom
D8  ESD321DPYR_C2868952  [X1SON-2_L1.0-W0.6-P0.65-RD]  28.09 1.46 270 bottom
GPS  MAX-M10S-00B-01  [GPS-SMD_18P-L10.1-W9.7-P1.10-BR]  45.07 45.62 0 top
H3LI  H3LIS331DL  [LGA-16_L3.0-W3.0-P0.50-BL]  14.11 36.03 90 top
JP1  U.FL-R-SMT-1(10)  [ANT-SMD_UFL-R-SMT-1-10]  43.02 53.4 0 top
L1  27nH  [L0603]  36.73 48.1 90 top
LED  LED-0603_B  [LED0603_BLUE]  19.66 19.05 180 top
NOREF  -  [Pad_e72]  55 5 0 top
NOREF#2  -  [Pad_e1]  55 60 0 top
NOREF#3  -  [Pad_e70]  5 5 0 top
NOREF#4  -  [Pad_e0]  5 60 0 top
OSCILLATOR  ABM8-272  [CRYSTAL-SMD_4P-L3.2-W2.5-BL]  33.2 43.3 90 top
P_ARM1  DB125-3.81-2P-RD  [CONN-TH_DB125-3.81-2P-RD]  3.5 15.8 270 top
P_ARM2  DB125-3.81-2P-RD  [CONN-TH_DB125-3.81-2P-RD]  3.5 46.9 270 top
P_CH1  DB125-3.81-2P-RD  [CONN-TH_DB125-3.81-2P-RD]  14.9 61.5 180 top
P_CH2  DB125-3.81-2P-RD  [CONN-TH_DB125-3.81-2P-RD]  24.9 61.5 180 top
P_CH3  DB125-3.81-2P-RD  [CONN-TH_DB125-3.81-2P-RD]  35.2 61.4 180 top
P_CH4  DB125-3.81-2P-RD  [CONN-TH_DB125-3.81-2P-RD]  45.2 61.5 180 top
POWER  DB125-3.81-2P-RD  [CONN-TH_DB125-3.81-2P-RD]  15.87 3.51 0 top
Q1  KAO3400  [SOT-23-3_L2.9-W1.3-P1.90-LS2.4-BR]  14.43 55.1 90 top
Q2  KAO3400  [SOT-23-3_L2.9-W1.3-P1.90-LS2.4-BR]  23.28 54.77 0 top
Q3  KAO3400  [SOT-23-3_L2.9-W1.3-P1.90-LS2.4-BR]  32.68 54.97 0 top
Q4  KAO3400  [SOT-23-3_L2.9-W1.3-P1.90-LS2.4-BR]  46.94 55.71 0 top
R1  1k  [R0603]  22.4 18.4 90 top
R2  22.7  [R0603]  29.86 14.47 270 top
R3  10k  [R0603]  31.72 48.76 90 bottom
R5  5.1K  [R0603]  33.34 10.72 270 bottom
R7  10k  [R0603]  17.97 56.27 0 top
R8  220  [R0603]  13.86 51.86 90 top
R9  4.7k  [R0603]  38.2 32.7 0 top
R10  220  [R0603]  24.16 50 90 top
R11  10k  [R0603]  27.51 54.81 90 top
R12  4.7k  [R0603]  38.1 36.1 0 top
R13  22.7  [R0603]  28.3 14.47 270 top
R14  10  [R0603]  43.98 49.72 270 bottom
R15  1k  [R0603]  49.33 10.2 270 bottom
R16  1k  [R0603]  32.01 40.01 180 bottom
R17  0  [R0603]  53.63 42.19 180 top
R18  0  [R0603]  53.61 43.92 180 top
R19  10k  [R0603]  35.97 55.69 0 top
R20  220  [R0603]  35.97 54.19 180 top
R21  220  [R0603]  49.78 53.22 90 top
R22  10k  [R0603]  51.62 57.2 0 top
R23  5.1K  [R0603]  26.01 11.07 270 bottom
R24  4.7k  [R0603]  18.9 38.6 90 top
R25  4.7k  [R0603]  19.81 35.06 270 bottom
REGULATOR  TLV76733DRVT  [WSON-6_L2.0-W2.0-P0.65-TL-EP]  20.42 13.32 270 top
RESET  PTS645SH50SMTR92LFS  [KEY-SMD_4P-L6.0-W6.0-P4.50-LS9.0]  56.31 15.54 270 top
RP2040  RP2040  [LQFN-56_L7.0-W7.0-P0.4-EP]  30.07 34.9 180 top
TEST  DB125-3.81-3P-RD  [CONN-TH_3P-P3.81_L7.4-W11.4]  3.4 30.8 270 top
U1  W25Q128JVSIQ  [SOIC-8_L5.3-W5.3-P1.27-LS8.0-BL]  35 20.4 270 bottom
USB  USB-TYPE-C-018  [USB-C_SMD-TYPE-C-31-M-12]  29.96 5.07 0 top

## Footprints (pads in the part's own frame, mm; a bottom-side part is the same pattern mirrored in y, then rotated)
ANT-SMD_UFL-R-SMT-1-10
  rect 2.2x1.1 smd: 1(0.625,1.5) 3(0.625,-1.5)
  rect 1.5x1.1 smd: 2(-0.625,0.001)
C0402
  rect 0.79x0.54 smd: 1(-0.545,0) 2(0.545,0)
C0603
  rect 0.8x0.9 smd: 1(-0.7,0) 2(0.7,0)
CONN-TH_3P-P3.81_L7.4-W11.4
  round 2.5 hole 1.5: 1(-3.81,0) 2(0,0) 3(3.81,0)
CONN-TH_DB125-3.81-2P-RD
  rect 2.5x2.5 hole 1.5: 1(-1.905,0)
  round 2.5 hole 1.5: 2(1.905,0)
CRYSTAL-SMD_4P-L3.2-W2.5-BL
  rect 1.4x1.2 smd: 1(-1.1,-0.85) 2(1.1,-0.85) 3(1.1,0.85) 4(-1.1,0.85)
GPS-SMD_18P-L10.1-W9.7-P1.10-BR
  rect 1.8x0.8 smd: 1(4.657,-4.4) 2(4.657,-3.3) 3(4.657,-2.2) 4(4.657,-1.1) 5(4.657,0) 6(4.657,1.1) 7(4.657,2.2) 8(4.657,3.3) 9(4.657,4.4) 10(-4.657,4.4) 11(-4.657,3.3) 12(-4.657,2.2) 13(-4.657,1.1) 14(-4.657,0) 15(-4.657,-1.1) 16(-4.657,-2.2) 17(-4.657,-3.3) 18(-4.657,-4.4)
KEY-SMD_4P-L6.0-W6.0-P4.50-LS9.0
  rect 1.9x1.3 smd: 1(-4.2,2.25) 2(4.2,2.25) 3(-4.2,-2.25) 4(4.2,-2.25)
L0603
  rect 0.8x0.864 smd: 1(-0.7,0) 2(0.7,0)
LED0603_BLUE
  rect 0.9x1 smd: 1(-0.85,0) 2(0.85,0)
LGA-10_L2.0-W2.0-P0.50-TL_BMP581
  rect 0.3x0.3 smd: 1(-0.78,0.25) 2(-0.78,-0.25) 3(-0.5,-0.78) 4(0,-0.78) 5(0.5,-0.78) 6(0.78,-0.25) 7(0.78,0.25) 8(0.5,0.78) 9(0,0.78) 10(-0.5,0.78)
LGA-16_L3.0-W3.0-P0.50-BL
  rect 0.28x0.6 smd: 1(-1,-1.343) 2(-0.5,-1.343) 3(0,-1.343) 4(0.5,-1.343) 5(1,-1.343) 9(1,1.343) 10(0.5,1.343) 11(0,1.343) 12(-0.5,1.343) 13(-1,1.343)
  rect 0.6x0.28 smd: 6(1.343,-0.5) 7(1.343,0) 8(1.343,0.499) 14(-1.343,0.499) 15(-1.343,0) 16(-1.343,-0.5)
LGA-28_L5.2-W3.8-P0.50-BL
  rect 0.5x0.25 smd: 1(-1.563,-2.25) 6(1.563,-2.25) 7(1.563,-1.75) 8(1.563,-1.25) 9(1.563,-0.75) 10(1.563,-0.25) 11(1.563,0.25) 12(1.563,0.75) 13(1.563,1.25) 14(1.563,1.75) 15(1.563,2.25) 20(-1.563,2.251) 21(-1.563,1.75) 22(-1.563,1.25) 23(-1.563,0.75) 24(-1.563,0.25) 25(-1.563,-0.25) 26(-1.563,-0.75) 27(-1.563,-1.25) 28(-1.563,-1.75)
  rect 0.25x0.5 smd: 2(-0.75,-2.25) 3(-0.25,-2.25) 4(0.25,-2.25) 5(0.75,-2.25) 16(0.75,2.25) 17(0.25,2.25) 18(-0.25,2.25) 19(-0.75,2.25)
LQFN-56_L7.0-W7.0-P0.4-EP
  rect 1.1x0.2 smd: 1(-3.55,2.6) 2(-3.55,2.2) 3(-3.55,1.8) 4(-3.55,1.4) 5(-3.55,1) 6(-3.55,0.6) 7(-3.55,0.2) 8(-3.55,-0.2) 9(-3.55,-0.6) 10(-3.55,-1) 11(-3.55,-1.4) 12(-3.55,-1.8) 13(-3.55,-2.2) 14(-3.55,-2.6) 29(3.55,-2.6) 30(3.55,-2.2) 31(3.55,-1.8) 32(3.55,-1.4) 33(3.55,-1) 34(3.55,-0.6) 35(3.55,-0.2) 36(3.55,0.2) 37(3.55,0.6) 38(3.55,1) 39(3.55,1.4) 40(3.55,1.8) 41(3.55,2.2) 42(3.55,2.6)
  rect 0.2x1.1 smd: 15(-2.6,-3.55) 16(-2.2,-3.55) 17(-1.8,-3.55) 18(-1.4,-3.55) 19(-1,-3.55) 20(-0.6,-3.55) 21(-0.2,-3.55) 22(0.2,-3.55) 23(0.6,-3.55) 24(1,-3.55) 25(1.4,-3.55) 26(1.8,-3.55) 27(2.2,-3.55) 28(2.6,-3.55) 43(2.6,3.55) 44(2.2,3.55) 45(1.8,3.55) 46(1.4,3.55) 47(1,3.55) 48(0.6,3.55) 49(0.2,3.55) 50(-0.2,3.55) 51(-0.6,3.55) 52(-1,3.55) 53(-1.4,3.55) 54(-1.8,3.55) 55(-2.2,3.55) 56(-2.6,3.55)
  rect 3.1x3.1 smd: 57(0,0)
Pad_e0
  round 4 hole 2: 1(0,0)
Pad_e1
  round 4 hole 2: 2(0,0)
Pad_e70
  round 4 hole 2: 4(0,0)
Pad_e72
  round 4 hole 2: 3(0,0)
R0603
  rect 0.806x0.864 smd: 1(-0.753,0) 2(0.753,0)
SOIC-8_L5.3-W5.3-P1.27-LS8.0-BL
  oval 0.63x2.25 smd: 1(-1.905,-3.53) 2(-0.635,-3.53) 3(0.635,-3.53) 4(1.905,-3.53) 5(1.905,3.53) 6(0.635,3.53) 7(-0.635,3.53) 8(-1.905,3.53)
SOT-23-3_L2.9-W1.3-P1.90-LS2.4-BR
  rect 1.25x0.7 smd: 1(1,-0.95) 2(1,0.95) 3(-1,0)
USB-C_SMD-TYPE-C-31-M-12
  oval 1.2x2 hole 0.8x1.6: 0(-4.325,1.706) 1(4.325,1.706)
  oval 1.2x1.8 hole 0.8x1.4: 2(4.325,-2.474) 3(-4.325,-2.474)
  rect 0.3x1.3 smd: A1(-3.35,2.474) A4(-2.55,2.474) A5(-1.25,2.474) A6(-0.25,2.474) A7(0.25,2.474) A8(1.25,2.474) A9(2.55,2.474) A12(3.35,2.474) B1(3.05,2.474) B4(2.25,2.474) B5(1.75,2.474) B6(0.75,2.474) B7(-0.75,2.474) B8(-1.75,2.474) B9(-2.25,2.474) B12(-3.05,2.474)
WSON-6_L2.0-W2.0-P0.65-TL-EP
  oval 0.607x0.364 smd: 1(-1.028,0.65) 2(-1.028,0) 3(-1.028,-0.65) 4(1.028,-0.65) 5(1.028,0) 6(1.028,0.65)
  rect 1x1.6 smd: 7(0,0)
X1SON-2_L1.0-W0.6-P0.65-RD
  rect 0.4x0.6 smd: 1(-0.325,0) 2(0.325,0)
X1SON-2_L1.0-W0.6-P0.65-RD-1
  rect 0.4x0.6 smd: 1(-0.325,0) 2(0.325,0)

## Nets
As in the schematic, except:
+5V: C14.2 D1.1 POWER.1 REGULATOR.4 REGULATOR.6 USB.A4 USB.A9 USB.B4 USB.B9
GND: BMP.3 BMP.5 BMP.8 BMP.9 BNO.2 BNO.5 BNO.6 BNO.15 BNO.16 BNO.17 BNO.18 BNO.25 BOOT.3 BOOT.4 C1.1 C2.1 C3.1 C4.1 C5.1 C6.1 C7.1 C8.1 C9.1 C10.1 C11.1 C12.2 C13.1 C14.1 C15.1 C16.1 C17.1 C18.2 C20.1 C21.1 C22.2 C23.1 C24.1 C25.2 C26.1 C27.1 C28.1 COMM.2 D1.2 D5.2 D8.2 GPS.1 GPS.10 GPS.12 H3LI.5 H3LI.7 H3LI.10 H3LI.12 H3LI.13 H3LI.16 JP1.1 JP1.3 LED.2 OSCILLATOR.2 OSCILLATOR.4 P_ARM2.1 POWER.2 Q1.2 Q2.2 Q3.2 Q4.2 R5.1 R7.2 R11.2 R19.2 R22.2 R23.1 REGULATOR.3 REGULATOR.5 REGULATOR.7 RESET.3 RESET.4 RP2040.57 TEST.2 U1.4 USB.0 USB.1 USB.2 USB.3 USB.A1 USB.A12 USB.B1 USB.B12
BOOT: BOOT.1 BOOT.2 R15.2
USB_D+: D5.1 R2.2 USB.A6 USB.B6
USB_D-: D8.1 R13.2 USB.A7 USB.B7
$1N33: LED.1 R1.2
$2N25: R23.2 USB.A5
$2N26: R5.2 USB.B5

Pads without a net: BMP 7; BNO 1 4 7 8 10 11 12 13 14 21 22 23 24 26 27; GPS 4 5 6 9 13 15 18; H3LI 2 3 9 11; NOREF 3; NOREF#2 2; NOREF#3 4; NOREF#4 1; RP2040 2 3 4 5 8 12 13 14 15 16 17 18 19 24 25 27 28 29 30 38 39 40 41; USB A8 B8

## Via types
v1: diameter 0.61, hole 0.305, Top Layer to Bottom Layer, 92 vias

## Routing (per net, layer and track width the routed paths; a pad name or vN(x,y) marks a point on that pad's centre or on a via; arc(x,y) is an arc through that point)
3V3: length 102.9
  Top Layer w0.254: 13.77,33.74 13.82,33.69 13.82,32.48 ; 13.77,33.74 13.87,33.74 14.06,33.92 14.06,34.45 ; 13.77,33.74 13.59,33.92 13.59,34.53 13.58,34.54 ; 13.77,33.74 v1(12.67,33.74) ; v1(24,32.3) 26.52,32.3 ; 33.62,35.9 33.64,35.92 35.28,35.92 v1(35.3,35.9) ; v1(41.31,32.98) 39.2,32.98 39.02,32.8 39.02,32.76 R9.2 38.95,32.32 v1(37.79,31.15) ; 27.86,30.9 27.86,30.02 27.32,29.48 v1(27.26,29.48) ; 29.49,31.35 29.49,29.46 29.57,29.38 v1(29.66,29.38) ; 29.49,31.35 RP2040.49 ; 29.49,31.35 RP2040.48 ; 43.88,25.11 BMP.10 ; 43.88,25.11 43.65,25.11 BMP.1 43.36,24.53 42.86,24.03 BMP.6 ; 43.88,25.11 46.45,25.11 47.24,25.89 ; 27.48,30.92 27.48,30.6 26.42,29.55 v1(26.42,29.46) ; H3LI.8 13.61,37.61 13.27,37.96 v1(11.39,37.96) ; 11.95,32.28 12.1,32.43 13.67,32.43 13.94,32.16 ; v1(30.27,37.31) 29.87,37.7 RP2040.22 ; 17.03,32.46 16.99,32.5 16.99,33.45 15.44,35 ; 45.72,35.38 46.52,35.38 v1(46.54,35.4) ; RP2040.33 26.5,35.88 24.48,35.88 24.12,35.52 24.12,35.04 24.14,35.01 24.14,34.66 23.79,34.31 R25.2 ; 29.88,38.45 29.88,40.54 v1(29.76,40.66) ; v1(45.03,32.89) 45.06,32.92 45.06,34.19 45.05,34.19 45.05,34.19 ; v1(40.32,36.47) 39.22,36.47 R12.2 ; v1(34.64,33.46) 35.29,33.46 36.19,32.56 36.19,32.31 36.18,32.3 v1(35.3,32.3) 35.28,32.32 33.64,32.32 RP2040.1
  Bottom Layer w0.254: v1(12.67,33.74) 11.39,35.02 v1(11.39,37.96) ; 47.76,35.38 47.74,35.4 v1(46.54,35.4) ; C7.2 26.42,28.47 v1(26.42,29.46) ; C11.2 29.66,28.68 v1(29.66,29.38) 29.66,33.55 29.31,33.9 27.96,33.9 27.71,33.66 27.23,33.66 26.89,34 26.89,34.49 27.23,34.83 27.71,34.83 27.93,34.61 29.02,34.61 30.27,35.87 v1(30.27,37.31) ; v1(27.26,29.48) 27.26,28.48 C6.2 ; v1(35.3,32.3) 36.3,31.3 C1.2 37.38,30.75 v1(37.79,31.15) ; 44.02,31.9 44.05,31.9 v1(45.03,32.89) 45.74,32.19 45.74,31.86 ; v1(23.93,34.9) 22.95,34.9 C4.2 ; C5.2 v1(24,32.3) ; 31.97,22.37 31.97,23.43 33.17,24.62 ; v1(34.64,33.46) 34.46,33.63 31.98,33.63 31.64,33.98 31.64,34.46 31.98,34.8 32.47,34.8 32.7,34.57 34.88,34.57 35.09,34.37 35.32,34.37 C2.2 35.43,34.61 35.43,35.78 v1(35.3,35.9) ; 29.81,41.53 29.81,40.7 v1(29.76,40.66) ; v1(40.32,36.47) 40.32,36.21 40.15,36.04 39.67,36.04 39.33,35.7 39.33,35.22 41.31,33.24 v1(41.31,32.98)
+1V: length 21.8
  Top Layer w0.254: v1(28.05,29.39) 28.27,29.6 ; 28.27,32.52 28.27,33.21 28.06,33.42 28.06,34.53 27.62,34.98 27.62,35.95 29.47,37.81 RP2040.23 29.47,40.03 v1(29,40.5) ; 28.27,32.52 RP2040.45 28.27,29.6 ; 28.27,32.52 28.56,32.81 29.46,32.81 30.25,32.02 30.25,31.37 RP2040.50 30.27,29.45 30.38,29.34 v1(30.42,29.34)
  Bottom Layer w0.254: v1(30.42,29.34) 30.49,29.28 30.49,29.16 C20.2 ; 28.57,41.49 28.57,41.49 28.57,40.93 v1(29,40.5) ; v1(28.05,29.39) 28.8,28.64 C21.2
+5V: length 44.6
  Top Layer w0.254: 21.09,12.28 21.37,12.28 22.77,10.87 25.91,10.87 ; 21.09,12.28 21.09,11.51 20.8,11.22 20.18,11.22 19.77,11.62 REGULATOR.4 18.4,10.92 18.4,7.94 POWER.1 ; 21.09,12.28 REGULATOR.6 ; v1(33.06,5.14) 33.05,5.12 31.68,5.12 31.67,5.14 ; 27.55,7.68 27.55,8.64 27.33,8.85 27.33,9.73 26.2,10.87 25.91,10.87 ; 25.91,10.87 26.3,11.26 26.3,13.89 25.66,14.53 23.13,14.53 C14.2 ; 31.67,5.14 31.67,6.21 32.33,6.87 32.33,7.53 ; 31.67,5.14 31.65,5.12 v1(31.65,5.09) 31.67,5.11 31.67,5.14 ; 27.55,7.38 27.55,6.91 27.86,6.6 27.86,5.34 v1(27.7,5.19)
  Bottom Layer w0.254: 32.52,1.78 32.52,3.58 33.06,4.12 v1(33.06,5.14) ; v1(27.7,5.19) 27.93,4.96 31.52,4.96 v1(31.65,5.09)
GND: length 473.6
  Top Layer w0.254: REGULATOR.7 19.97,12.87 19.58,12.87 18.6,11.9 16.31,11.9 15.24,12.97 v1(15.24,13.01) 17.81,13.01 C8.1 ; REGULATOR.7 20.64,13.1 C14.1 24.94,13.1 v1(25.04,13) ; REGULATOR.7 19.77,13.97 REGULATOR.3 19.77,15.61 18.81,16.57 LED.2 ; REGULATOR.7 REGULATOR.5 ; 49.48,1.45 52.13,4.11 52.13,9.62 53.75,11.24 53.78,11.24 ; 52.44,58.72 50.13,58.72 48.21,56.79 ; 49.12,1.04 49.04,0.96 40.82,0.96 ; 34.04,6.37 33.88,6.37 33.11,7.15 33.11,7.18 ; 14.09,36.99 14.07,36.99 13.74,36.67 13.75,36.66 ; 14.09,36.99 13.75,36.66 ; 14.09,36.99 14.09,37.33 14.1,37.34 ; 52.46,57.32 52.46,62.85 50.74,64.57 34.91,64.57 ; 41.97,35.45 41.97,36.09 41.6,36.45 BNO.16 BNO.15 41.05,37.53 42.58,39.06 C26.1 42.65,39.14 42.65,40.01 43.3,40.67 ; 41.97,35.45 43.06,35.45 43.75,34.76 ; 41.97,35.45 41.7,35.45 ; 42.37,22.62 42.33,22.66 BMP.5 42.24,24.03 v1(40.87,24.03) ; 42.37,22.62 43.85,22.62 ; 42.37,22.62 v1(42.37,18.87) ; 40.4,0.96 40.3,1.06 38.99,1.06 37.44,2.61 34.3,2.61 ; 48.21,56.79 48.39,56.79 46.5,54.9 JP1.1 JP1.3 43.58,51.97 42.4,51.97 41.52,51.09 ; 48.21,56.79 48.07,56.79 Q4.2 ; 48.21,56.79 48.2,56.78 ; 12.76,35.5 12.76,35 11.93,35 9.62,32.69 9.62,30.8 ; R7.2 19.41,56.27 21.54,54.14 23.02,54.14 23.18,54.3 23.18,55.56 23.35,55.72 24.28,55.72 ; 35.06,58.41 35.06,63.21 34.91,63.36 34.91,64.57 ; 35.06,58.41 33.8,57.16 33.8,56.01 ; 35.06,58.41 35.09,58.38 35.5,58.38 36.68,57.19 36.68,55.69 ; 35.06,58.41 34.97,58.41 ; 17.79,3.41 18.72,2.49 ; 27.53,55.73 27.45,55.66 24.39,55.66 ; 12.77,36.53 13.59,36.5 13.75,36.66 ; v1(23.96,10.15) 26.56,7.54 USB.A1 ; 34.91,64.57 26.12,64.57 24.85,63.3 ; H3LI.12 12.41,35.53 12.08,35.86 12.08,36.28 12.33,36.53 H3LI.10 ; 43.75,34.76 43.94,34.95 44.7,34.95 ; 43.75,34.76 43.55,34.56 BNO.25 43.55,33.3 42.54,32.29 v1(42.54,32.1) ; v1(47.31,36.49) 47.09,36.27 47.09,35.67 47.47,35.29 47.47,34.53 47.21,34.28 46.83,34.28 46.16,34.95 BNO.2 ; BNO.18 41.7,35.45 ; 41.7,35.45 41.2,35.95 BNO.17 ; 26.77,7.27 26.77,7.11 26.05,6.39 25.93,6.39 ; 49.72,41.17 43.81,41.17 43.3,40.67 ; 54.06,11.53 54.06,19.52 54.12,19.57 ; v1(35.5,9.16) 33.88,7.54 USB.A12 USB.B1 ; 34.14,6.37 34.14,2.49 ; 34.23,2.54 34.24,2.53 ; 14.61,34.69 14.6,34.7 14.6,35.04 14.05,35.58 13.62,35.58 13.07,35.03 H3LI.13 ; 24.39,55.78 24.39,60.09 24.81,60.51 24.81,63.26 24.85,63.3 ; 13.75,36.66 14.07,36.35 14.44,36.35 15.12,37.03 H3LI.5 16.23,37.03 v1(16.35,37.15) ; 41.52,51.09 42.87,49.74 42.87,48.1 42.68,47.91 ; 41.52,51.09 40.4,49.97 ; BNO.2 48.23,32.27 48.23,28.89 48.77,28.34 C18.2 48.77,24.56 48.33,24.12 44.44,24.12 44.44,22.99 44.07,22.62 43.85,22.62 ; BNO.2 44.7,34.95 ; v1(26.72,39.55) 25.25,39.55 C10.1 ; 53.86,19.78 53.86,21.66 49.84,25.68 48.93,25.68 48.91,25.7 ; 24.19,2.49 23.57,3.11 23.57,6.19 24.12,6.74 25.51,6.74 ; 24.19,2.49 v1(22.25,2.49) 18.72,2.49 ; 24.19,2.49 25.36,2.49 ; C10.1 24.03,40.63 v1(22.62,40.63) ; C10.1 24.1,42.4 24.1,44.1 26.06,44.1 C16.1 27.28,44.18 v1(27.66,43.8) ; v1(49.27,33.21) 51.94,30.54 COMM.2 ; 9.62,30.8 12.03,30.8 12.08,30.86 C23.1 12.32,30.79 13.64,30.79 13.86,31 17.02,31 C22.2 20.24,30.95 v1(20.3,30.89) ; 9.62,30.8 TEST.2 ; BMP.9 BMP.8 43.89,22.66 43.85,22.62 ; 42.68,47.91 42.54,47.77 40.4,47.77 ; 42.68,47.91 42.68,47.86 43.3,47.23 43.3,40.67 ; C13.1 36.47,45.7 v1(36.97,45.7) 37.57,45.1 C15.1 36.62,44.4 OSCILLATOR.2 34.05,43.9 OSCILLATOR.4 31.69,42.2 30.63,43.26 v1(30.63,44.18) ; 44.7,34.95 44.7,35.87 45.18,36.35 45.19,36.35 45.29,36.45 BNO.5 BNO.6 ; R19.2 38.72,55.69 v1(38.78,55.63) ; 36.7,55.66 36.75,55.62 ; 9.45,56.35 9.45,62.54 11.38,64.47 23.67,64.47 24.85,63.3 ; v1(41.28,25.42) 41.57,25.12 BMP.3 ; v1(32.23,34.22) 31.54,34.9 RP2040.57 28.52,34.9 v1(28.2,35.22) ; GPS.12 40.33,47.74 v1(38.19,47.74) ; 2.95,48.82 2.95,50.45 v1(6.42,53.93) 8.79,56.29 13.47,56.29 13.53,56.35
  Bottom Layer w0.254: 34.65,28.89 32.91,27.16 32.15,27.16 ; 34.65,28.89 34.65,32.6 C2.1 34.74,34.22 v1(32.23,34.22) ; 34.65,28.89 35.41,29.66 C1.1 ; 38.93,18.5 41.99,18.5 v1(42.37,18.87) ; C12.2 37.79,53.38 38.78,54.37 v1(38.78,55.63) ; v1(38.19,47.74) 38.19,46.92 v1(36.97,45.7) ; v1(26.72,39.55) 28.2,38.07 v1(28.2,35.22) ; C17.1 27.66,43.73 v1(27.66,43.8) ; R5.1 34.46,11.47 35.5,10.44 v1(35.5,9.16) ; v1(22.62,40.63) 21.18,40.63 14.09,47.72 13.61,47.72 13.26,47.38 13.26,46.89 13.46,46.7 13.46,46.02 22.62,36.86 22.62,35.66 C4.1 21.85,32.4 C5.1 21.75,31.23 21.42,30.89 v1(20.3,30.89) ; v1(49.27,33.21) C25.2 49.27,35.78 48.57,36.49 v1(47.31,36.49) ; USB.3 26.22,2.6 27.74,1.08 28.41,1.08 28.97,0.52 30.68,0.52 31.23,1.08 32.77,1.08 USB.2 ; 32.15,27.16 C9.1 ; 32.15,27.16 C20.1 C11.1 C21.1 C6.1 C7.1 ; v1(40.87,24.03) 40.87,25.01 v1(41.28,25.42) ; 28.57,42.58 28.6,42.55 30.2,42.55 30.63,42.97 v1(30.63,44.18) ; v1(42.54,32.1) 42.54,31.06 43.26,30.33 C27.1 45.72,30.33 C28.1 ; v1(25.04,13) 25.04,12.8 R23.1 25.01,11.82 23.96,10.77 v1(23.96,10.15)
BOOT: length 12
  Top Layer w0.254: 49.08,5.51 48.92,5.66 40.81,5.66 ; 49.31,5.83 v1(49.31,7.48)
  Bottom Layer w0.254: 49.31,9.48 v1(49.31,7.48) ; 49.3,9.47 49.31,9.48
GATE_TRIGGER1: length 22.5
  Top Layer w0.254: v1(24.71,35.28) 24.71,35.35 24.88,35.52 26.5,35.52 26.52,35.49 arc(26.56,35.5) 26.59,35.5 26.59,35.5 ; 13.8,51.28 13.85,51.23 v1(13.85,47.13)
  Bottom Layer w0.254: v1(24.71,35.28) 13.81,46.17 13.81,47.1
GATE_TRIGGER2: length 18.1
  Top Layer w0.254: 24.68,34.51 24.86,34.69 24.95,34.69 25.36,35.11 26.3,35.11 26.85,35.11 ; 24.32,49.2 24.16,49.04 v1(24.16,45.99)
  Bottom Layer w0.254: v1(24.73,34.52) 25,34.52 25.41,34.92 25.41,35.4 24.75,36.06 24.75,45.4 v1(24.16,45.99)
GATE_TRIGGER3: length 30.5
  Top Layer w0.254: v1(30.96,51.41) 34.68,51.41 36.81,53.54 36.81,53.9 36.73,53.99 ; 26.03,34.7 25.8,34.7 25.03,33.93 24.24,33.93 24.23,33.94
  Bottom Layer w0.254: v1(30.96,51.41) 30.22,51.41 26.13,47.32 26.13,35.82 25.81,35.5 25.81,34.75 24.98,33.91 v1(24.23,33.91)
GATE_TRIGGER4: length 35.1
  Top Layer w0.254: RP2040.37 27.42,34.3 v1(27.47,34.24) ; 49.78,52.47 48.66,52.47 47.8,51.61 47.8,45.84 v1(45.11,43.15)
  Bottom Layer w0.254: v1(45.11,43.15) 36.58,43.15 33.44,40.01 33.44,38.54 29.16,34.26 27.49,34.26 v1(27.47,34.24)
PWR_PYRO_5V: length 33.3
  Top Layer w0.5: P_ARM1.2 3.03,13.9 1.46,15.47 1.46,43.28 3.17,45 P_ARM2.2
PYRO_5V: length 96.1
  Top Layer w0.254: v1(10.55,62.28) 11.54,63.27 16.81,63.27 ; 16.81,63.27 v1(22.77,63.27) ; 16.81,63.27 P_CH1.1 ; P_CH4.1 47.1,63.43 v1(46.78,63.76) ; P_CH2.1 26.81,63.86 v1(26.94,63.99) ; P_CH3.1 36.7,61.81 v1(36.7,63.95)
  Top Layer w0.5: v1(3.54,22.17) 3.5,22.13 P_ARM1.1
  Bottom Layer w0.254: v1(10.55,62.28) 7.37,59.1 7.37,22.4 7.14,22.17 v1(3.54,22.17) ; v1(46.78,63.76) 46.59,63.95 v1(36.7,63.95) 36.66,63.99 v1(26.94,63.99) 25.02,63.99 24.3,63.27 v1(22.77,63.27)
Q_CS: length 30.5
  Top Layer w0.254: v1(38.46,25.32) 32.71,31.08 32.71,31.46
  Bottom Layer w0.254: 49.31,11.05 49.31,14.48 v1(38.46,25.32) 38.36,25.21 38.36,22.15 38.34,22.13
Q_SCLK: length 14.5
  Top Layer w0.254: v1(29.29,22.41) 29.26,22.41 29.13,22.54 29.13,23.16 31.38,25.41 31.38,27.59 31.41,27.62 31.41,29.8 31.08,30.13 31.08,31.44
  Bottom Layer w0.254: 31.87,19.77 31,19.77 29.24,21.52 29.24,22.36 v1(29.29,22.41)
QD_0: length 14.6
  Top Layer w0.254: 31.49,31.01 31.49,30.3 31.82,29.97 31.82,25.25 29.87,23.3 29.87,20.8 29.57,20.5 v1(29.57,19.96)
  Bottom Layer w0.254: v1(29.57,19.96) 29.57,19.69 30.88,18.38 31.25,18.38
QD_1: length 16.3
  Top Layer w0.254: 32.27,31.16 32.29,31.13 32.29,30.62 41.2,21.71 v1(41.2,21.3)
  Bottom Layer w0.254: v1(41.2,21.3) 41.19,21.3 41.03,21.14 38.61,21.14 38.52,21.04
QD_2: length 19.3
  Top Layer w0.254: 31.89,31.07 31.89,31.07 31.89,30.51 32.23,30.18 32.23,24.71 37.19,19.74 41.11,19.74
  Bottom Layer w0.254: 39.11,19.77 40.89,19.77 v1(40.93,19.81)
QD_3: length 12.2
  Top Layer w0.254: v1(30.8,25.9) 30.8,27.58 31.01,27.79 31.01,29.64 30.68,29.97 30.68,31.35
  Bottom Layer w0.254: v1(30.8,25.9) 30.8,24.35 30,23.55 30,21.9 30.93,20.97 31.81,20.97
RST: length 68.9
  Top Layer w0.254: 58.2,19.42 48.58,29.03 v1(48.58,37.87) ; 58.46,11.38 58.41,11.43 58.41,19.48 ; 25.45,40.42 27.48,40.42 28.29,39.6 28.29,38.61 28.27,38.63 ; v1(27.02,42.19) 27.02,41.65 25.84,40.47
  Bottom Layer w0.254: 31.74,47.92 31.74,46.44 31.72,46.43 ; 27.02,42.17 27.02,42.17 27.02,42.17 27.02,42.17 ; 27.02,42.17 27,42.19 27,44.55 28.83,46.38 34.22,46.38 35.75,44.85 45.29,44.85 48.58,41.56 48.58,37.88 v1(48.58,37.87)
RX_GPS: length 34.3
  Top Layer w0.254: v1(57.66,43.73) 57.64,43.7 54.68,43.7 ; v1(32.27,35.49) 33.61,35.49 RP2040.9
  Bottom Layer w0.254: 57.52,43.55 51.26,37.29 48.34,37.29 47.65,37.98 33.39,37.98 32.27,36.86 v1(32.27,35.49)
SCL: length 48.8
  Top Layer w0.254: 37.35,36.2 37.35,36.45 37.3,36.5 37.3,40.2 39.37,42.27 40.4,42.27 ; 37.35,36.2 37.25,36.2 ; 37.35,36.2 38.6,34.95 39.91,34.95 ; 37.25,36.2 36.7,36.2 35.2,34.7 33.98,34.7 ; 37.25,36.2 R12.1 37.35,34.73 v1(37.27,34.65) ; v1(38.43,30) 38.43,29.83 BMP.2 ; COMM.3 55.88,33.53 v1(53.39,33.53) ; 39.91,34.95 BNO.19 ; 39.91,34.95 v1(39.91,35.46)
  Bottom Layer w0.254: v1(38.43,30) 38.43,33.5 v1(37.27,34.65) ; v1(53.39,33.53) 49.94,33.53 49.86,33.45 49.86,32.97 49.52,32.62 49.03,32.62 48.13,33.53 42.2,33.53 40.27,35.46 v1(39.91,35.46)
SCL1: length 34.5
  Top Layer w0.2: 26.19,36.29 26.18,36.29 26.17,36.28 24.37,36.28 23.91,35.82 23.84,35.82
  Top Layer w0.254: 18.24,35.79 18.63,35.79 18.63,35.79 23.84,35.82 ; 18.24,35.79 18.2,35.76 18.2,33.5 18.9,32.8 v1(18.9,32.47) ; 18.24,35.79 17.91,35.79 17.91,35.79 17.67,35.79 16.97,36.49 15.45,36.49 15.44,36.5 ; TEST.3 16.57,26.99 v1(18.87,29.29)
  Bottom Layer w0.254: v1(18.87,29.29) 18.87,32.44 v1(18.9,32.47)
SDA: length 55.4
  Top Layer w0.254: 33.86,34.29 35.31,34.29 36.9,32.7 37.33,32.7 ; 39.85,34.14 38.78,34.14 37.45,32.8 ; 39.85,34.14 39.85,33.59 v1(39.84,33.58) ; 39.85,34.14 BNO.20 ; 42.33,24.62 40.03,24.62 37.08,27.57 37.08,32.45 37.33,32.7 ; 37.33,32.7 R9.1 37.45,32.8 ; 37.45,32.8 37.45,33.25 v1(36.5,34.2) ; 40.4,43.37 40.37,43.34 39.22,43.34 36.01,40.13 36.01,37.48 36.13,37.37 36.13,36.89 v1(36.26,36.75)
  Bottom Layer w0.254: v1(39.84,33.58) 39.84,32.26 45.93,26.17 56.14,26.17 COMM.1 ; v1(36.26,36.75) 36.26,34.44 v1(36.5,34.2)
SDA1: length 30.7
  Top Layer w0.254: R24.1 17.34,39.41 8.2,39.41 TEST.1 ; R24.1 19.13,37.61 24.59,37.61 25.48,36.72 26.5,36.72 26.52,36.7 ; R24.1 15.1,37.85 14.6,37.34
TX_GPS: length 29.8
  Top Layer w0.254: RP2040.11 34.12,36.3 34.14,36.32 34.31,36.32 v1(35.24,37.25) ; v1(57.5,42.2) 57.49,42.19 R17.1
  Bottom Layer w0.254: v1(35.24,37.25) 35.41,37.42 47.71,37.42 48.2,36.93 52.23,36.93 v1(57.5,42.2)
USB_D+: length 19.4
  Top Layer w0.254: v1(30.89,3.42) 30.71,3.6 USB.B6 ; R2.2 29.86,13.06 29.28,12.48 29.28,12.23 29.71,11.8 USB.A6 29.71,3.81 29.28,3.38 v1(29.16,3.38)
  Bottom Layer w0.254: 30,1.45 D5.1 ; 30,1.45 30,1.97 29.88,2.1 ; v1(29.16,3.38) 29.16,2.82 29.88,2.1 ; v1(30.89,3.42) 30.71,3.25 30.71,3.13 29.88,2.29 29.88,2.1
USB_D-: length 19.4
  Top Layer w0.254: 28.13,3.3 28.11,3.32 28.11,3.29 ; 28.13,3.3 28.63,2.8 29.56,2.8 v1(30.13,3.37) 30.18,3.42 30.18,7.51 USB.A7 ; 28.13,3.3 28.11,3.29 ; 28.13,3.3 28.57,3.75 28.57,3.84 29.21,4.47 USB.B7 ; 29.23,7.62 29.23,11.71 28.88,12.06 28.88,12.48 28.3,13.06 R13.2 ; 28.11,3.29 v1(28.07,3.25)
  Bottom Layer w0.254: D8.1 28.09,3.23 v1(28.07,3.25)
$1N33: length 1.9
  Top Layer w0.254: R1.2 22.3,19.05 LED.1
$1N42: length 16.7
  Top Layer w0.254: R13.1 28.39,15.22 28.51,15.34 28.51,16.81 28.3,17.02 28.3,18.23 28.26,18.28 28.26,19.55 28.3,19.59 28.3,21.28 28.26,21.32 28.26,22.59 28.3,22.64 28.3,24.84 28.21,24.94 28.21,26.16 28.3,26.25 28.3,28.67 28.67,29.05 RP2040.46
$1N55: length 8
  Top Layer w0.254: C15.2 34.92,42.2 OSCILLATOR.1 32.25,40.4 31.83,40.4 30.69,39.26 30.69,38.47 RP2040.20
$1N58: length 4.7
  Top Layer w0.254: RP2040.21 30.27,40.34 30.35,40.42 30.35,40.81 v1(30.92,41.38)
  Bottom Layer w0.254: v1(30.92,41.38) 31.25,41.04 R16.2
$1N60: length 12.4
  Top Layer w0.254: v1(30.45,45.53) 30.66,45.32 ; 30.66,45.32 C16.2 ; 30.66,45.32 31.57,44.4 OSCILLATOR.3
  Bottom Layer w0.254: v1(30.45,45.53) 30.79,45.87 32.27,45.87 32.76,45.38 R16.1
$1N1983: length 16.8
  Top Layer w0.254: 29.08,31.35 29.08,28.88 28.71,28.51 28.71,17.19 29.86,16.04 R2.1
$2N3: length 6.8
  Top Layer w0.254: 22.69,61.32 22.12,60.76 22.12,54.78
$2N4: length 7.4
  Top Layer w0.254: 14.48,54.35 14.48,58.06 12.91,59.63 12.91,60.85 13.09,61.02
$2N6: length 6.2
  Top Layer w0.254: 24.31,53.88 24.36,53.93 ; 24.34,53.85 27.38,53.85 ; 24.21,50.68 24.21,53.77
$2N9: length 8.2
  Top Layer w0.254: 15.37,56.01 16.99,56.01 17.1,56.11 ; 13.87,52.69 16.5,52.69 17.17,53.36 17.17,56.06 17.25,56.14
$2N14: length 3.1
  Top Layer w0.254: 34.04,54.19 34.88,54.19 ; 34.88,54.19 34.88,54.15 ; 34.88,54.19 35.11,54.42 35.11,55.52 34.95,55.68 ; 34.88,54.19 35.4,54.19 35.43,54.15
$2N17: length 5.8
  Top Layer w0.254: R22.1 50.87,55.07 R21.2 48.99,54.76 Q4.1
$2N19: length 6.9
  Top Layer w0.254: 33.37,61.27 33.37,59.69 31.91,58.22 31.91,55.01
$2N20: length 6.6
  Top Layer w0.254: 45.76,55.7 43.32,58.14 43.32,61.3
$2N25: length 3.8
  Top Layer w0.254: v1(27.91,9.09) 28.66,8.34 28.66,7.98
  Bottom Layer w0.254: v1(27.91,9.09) 27.04,9.09 26.01,10.13
$2N26: length 2.8
  Top Layer w0.254: 31.64,7.84 31.64,8.33 v1(32.2,8.89)
  Bottom Layer w0.254: 33.38,9.81 32.54,8.96 32.25,8.96
$2N49: length 18.9
  Top Layer w0.254: 40.36,48.8 40.31,48.75 36.69,48.75 36.69,48.61 ; 36.69,49.08 36.69,50.16 v1(36.69,50.17) ; 36.69,49.08 36.69,48.96 36.67,48.94 36.56,48.94 ; 36.69,49.08 40.91,53.29 41.85,53.29 41.86,53.29 ; 34.97,48.85 36.61,48.85 ; 40.6,48.69 41.98,48.69 v1(41.99,48.7) ; 36.62,48.73 36.64,48.75
  Bottom Layer w0.254: v1(36.69,50.17) 36.69,51.79 36.77,51.87 ; v1(41.99,48.7) 42.11,48.83 43.92,48.83
$2N54: length 4.5
  Top Layer w0.254: 36.91,47.54 36.72,47.35 36.72,47.32 38.39,45.65 40.07,45.65 40.16,45.55
$2N63: length 3.1
  Top Layer w0.254: 49.74,42.23 52.78,42.23 52.85,42.16
$2N64: length 3.2
  Top Layer w0.254: 50.05,43.29 51.03,43.29 51.72,43.98 52.87,43.98 52.9,43.94
$3N377: length 2
  Top Layer w0.254: 44.04,37.31 44.04,39.22 44.08,39.26

## Copper pours and planes (outline as drawn; the poured copper is in the pictures)
3V3 on Top Layer: 0.27,65.08 59.99,65.08 59.99,-0.06 0.27,-0.06
3V3 on Bottom Layer: 0.06,65.32 60.31,65.32 60.31,-0.12 0.06,-0.12
GND on GND: 0.26,64.74 59.74,64.74 59.74,0.26 0.26,0.26
GND on GND2: 0.26,64.74 59.74,64.74 59.74,0.26 0.26,0.26

Small or netless copper shapes (teardrops, artwork), in the pictures only: 32 on GND, 32 on GND2

## Text on the board
Top Silkscreen Layer: P_CH3 | + | SDA1 | SCL1 | SCL | SDA | - | 'That's one small step for a me, a giant leap for mankind'  - XD | KARMA
